# Altium project CPU_MOD.PrjPcb (part 1 of 2)
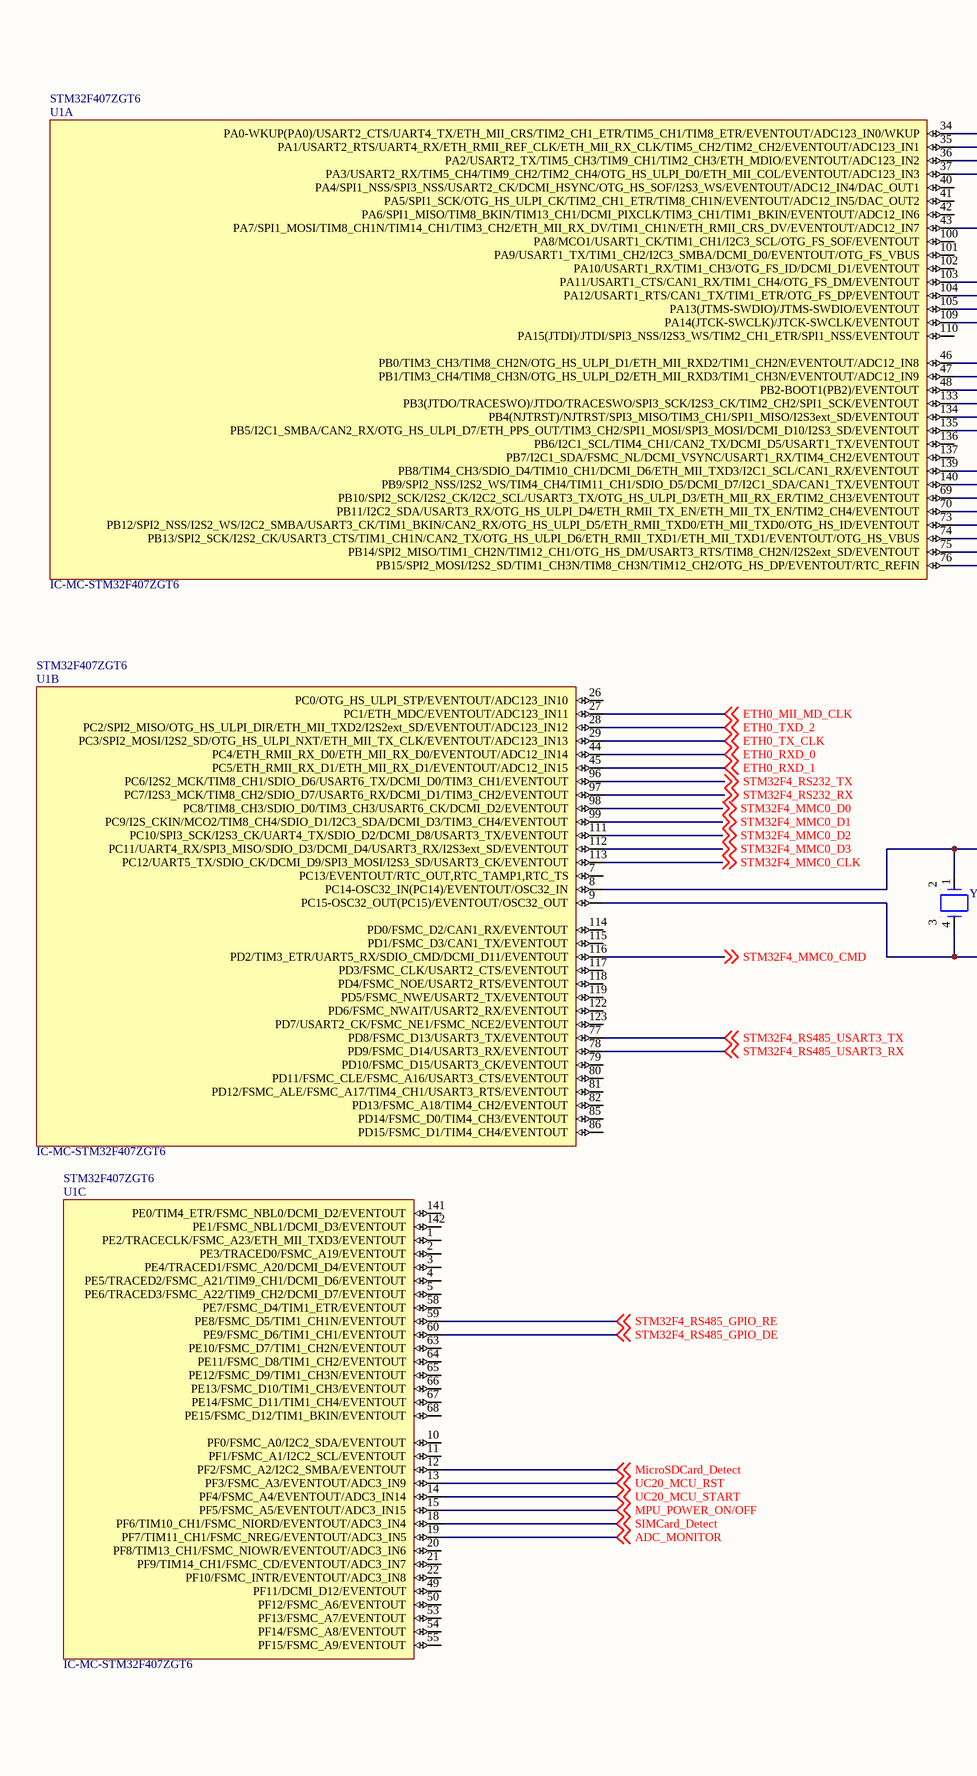
[diagram p0: [01] - CPU.SchDoc, left]
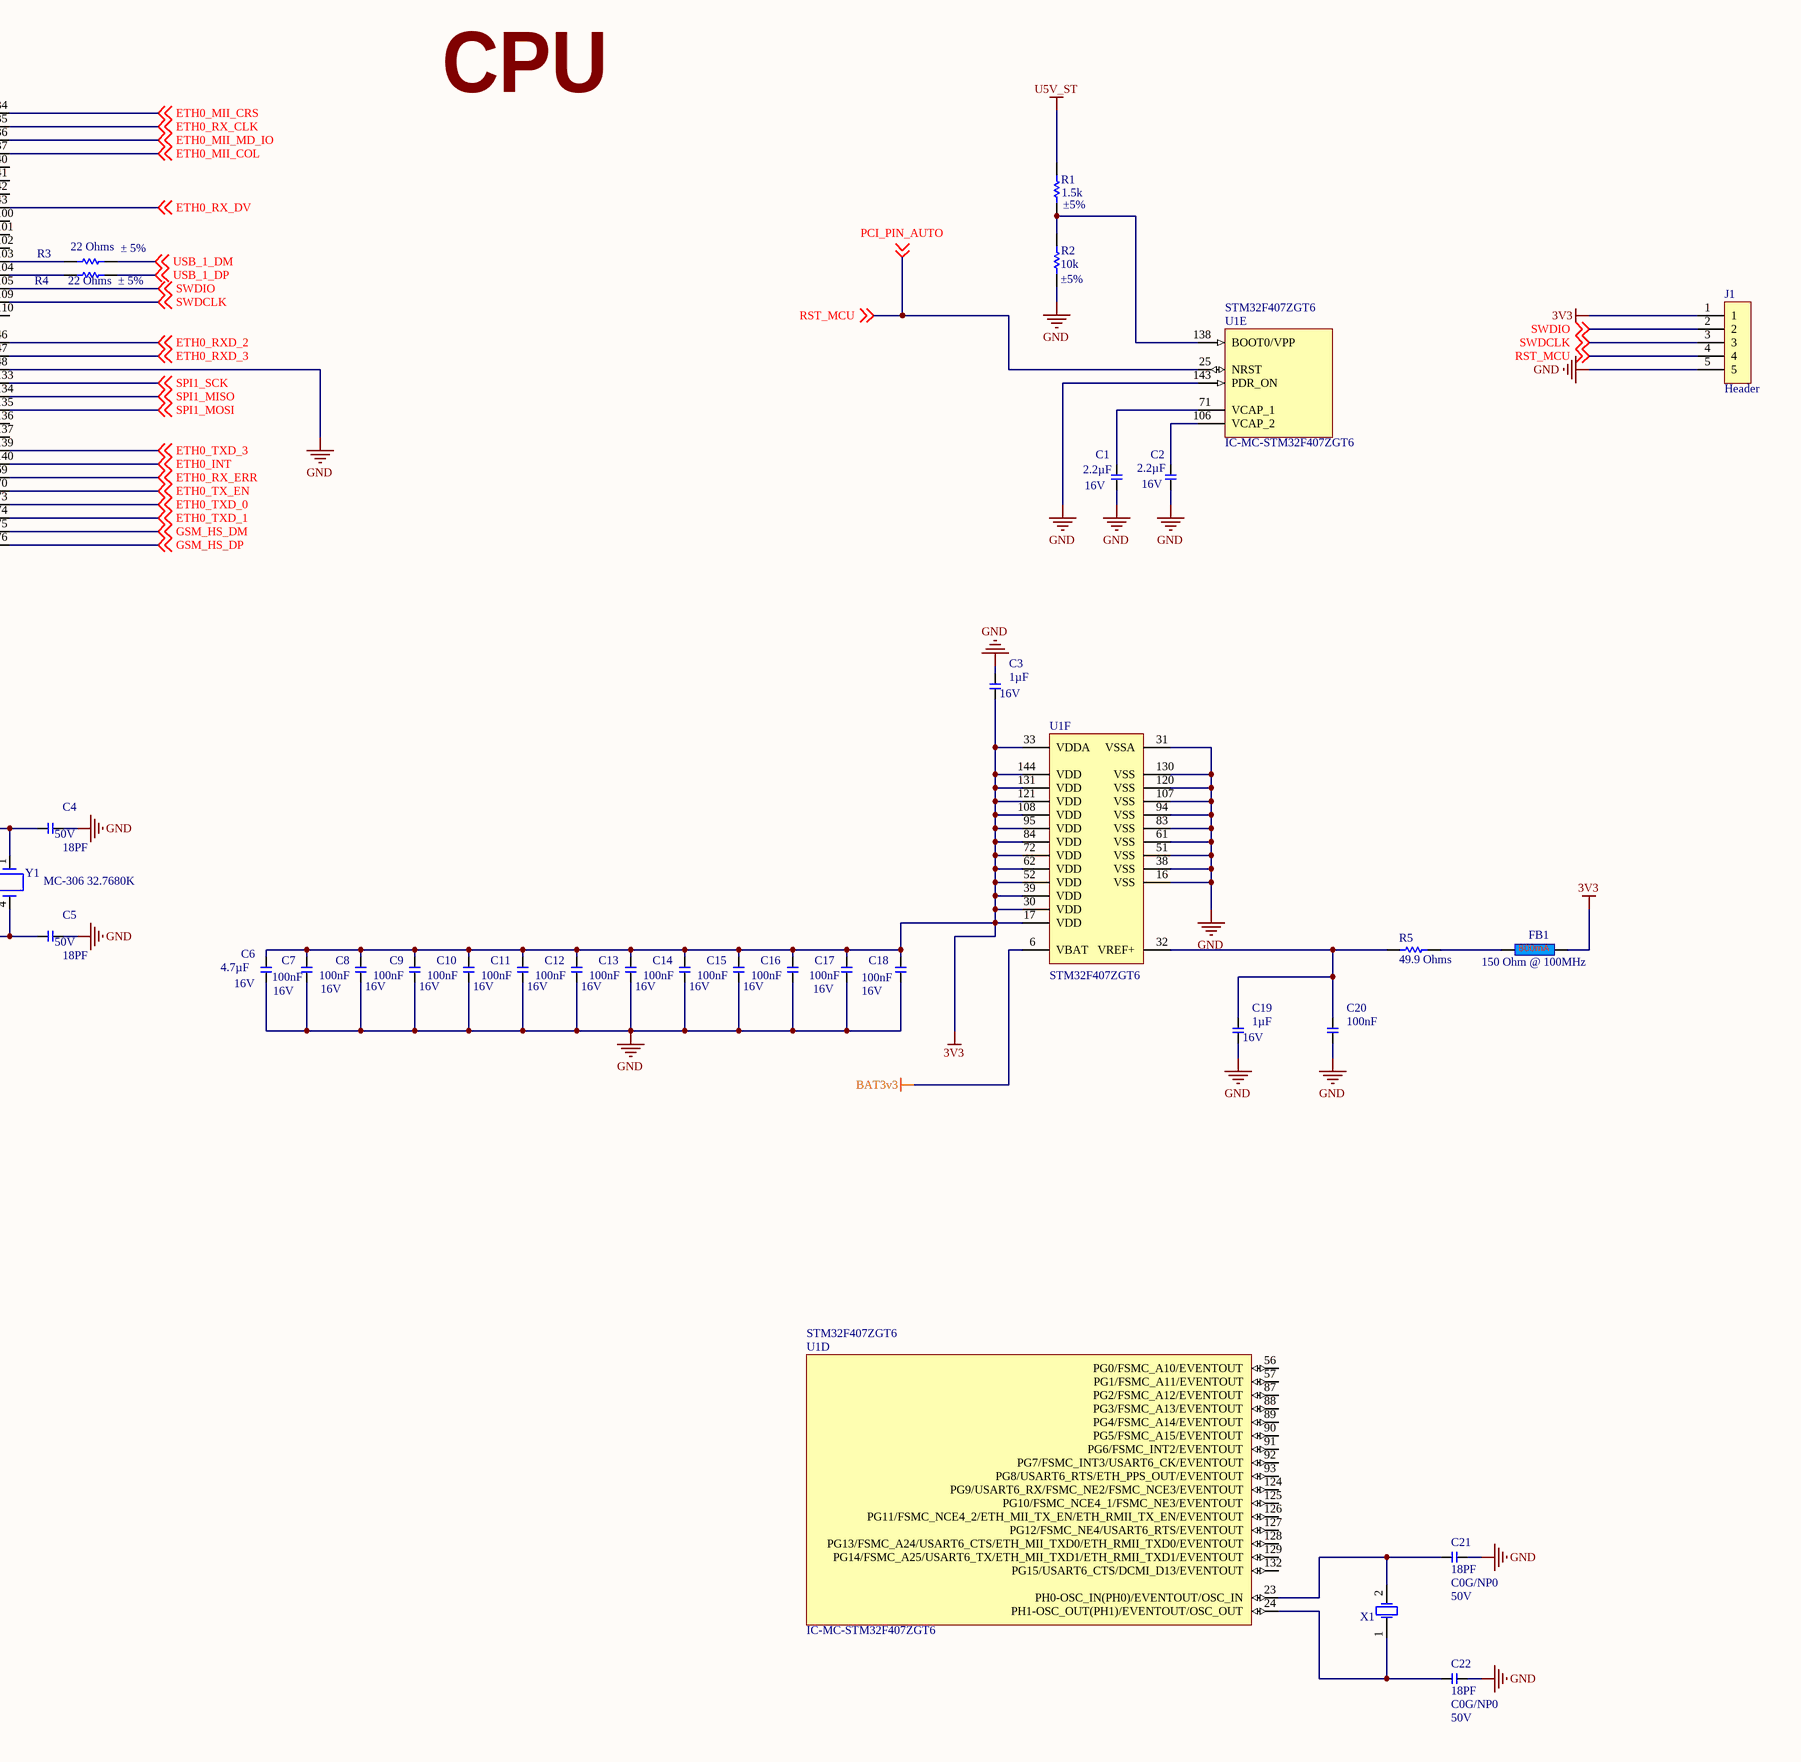
[diagram p1: [01] - CPU.SchDoc, right]
5 sheets, 70 parts. Net scope: global (net labels, ports and power ports of the same name join across sheets).
Board file: CPU_MOD.PcbDoc
Sheets:
  [01] - CPU.SchDoc
  [02] - RS232.SchDoc
  [03] - RS485.SchDoc
  [04] - ETHERNET.SchDoc
  [05] - MINIPCICONN.SchDoc

## Sheet [01] - CPU.SchDoc
size A2; Date: 25.05.2016; Engineer: Mustafa ÖZKAN; DocumentName: CPU Modul

### Parts
C1  Voltage - Rated: 16V  [C0805]  (hidden comment: 2.2µF)
C2  Voltage - Rated: 16V  [C0805]  (hidden comment: 2.2µF)
C3  1µF  Voltage - Rated: 16V  [C0805]
C4  18PF  voltage_rating_dc: 50V  [C0805]
C5  18PF  voltage_rating_dc: 50V  [C0805]
C6  4.7µF  Voltage - Rated: 16V  [C0805]
C7  100nF  Voltage - Rated: 16V  [C0805]
C8  100nF  Voltage - Rated: 16V  [C0805]
C9  100nF  Voltage - Rated: 16V  [C0805]
C10  100nF  Voltage - Rated: 16V  [C0805]
C11  100nF  Voltage - Rated: 16V  [C0805]
C12  100nF  Voltage - Rated: 16V  [C0805]
C13  100nF  Voltage - Rated: 16V  [C0805]
C14  100nF  Voltage - Rated: 16V  [C0805]
C15  100nF  Voltage - Rated: 16V  [C0805]
C16  100nF  Voltage - Rated: 16V  [C0805]
C17  100nF  Voltage - Rated: 16V  [C0805]
C18  100nF  Voltage - Rated: 16V  [C0805]
C19  1µF  Voltage - Rated: 16V  [C0805]
C20  100nF  [C0805]
C21  18PF  dielectric_characteristic: C0G/NP0  voltage_rating_dc: 50V  [C0805]
C22  18PF  dielectric_characteristic: C0G/NP0  voltage_rating_dc: 50V  [C0805]
FB1  150 Ohm @ 100MHz  [0805]
J1  Header  [Header 1x5 2.54mm]
R1  Tolerance: ±5%  [R0805]  (hidden comment: 1.5k)
R2  Tolerance: ±5%  Resistance (Ohms): 10k  [R0805]  (hidden comment: R-10K,%1,0805)
R3  22 Ohms  Resistance Tolerance: ± 5%  [R0805]
R4  22 Ohms  Resistance Tolerance: ± 5%  [R0805]
R5  49.9 Ohms  [R0805]
U1  IC-MC-STM32F407ZGT6  Manufacturer Part Number: STM32F407ZGT6  [STM-LQFP144_L]  (parts A,B,C,D,E,F of 6)
X1  ABM7-8.000MHZ  [SM_OSC_ABM3]  (value not drawn)
Y1  Manufacturer Part Number: MC-306 32.7680K  [CRSTAL_RTC]  (hidden comment: 32.7680 KHZ 12.5PF)

### Nets
3V3: C3.1 C6.2 C7.2 C8.2 C9.2 C10.2 C11.2 C12.2 C13.2 C14.2 C15.2 C16.2 C17.2 C18.2 FB1.2 J1.1 U1.17(VDD) U1.30(VDD) U1.33(VDDA) U1.39(VDD) U1.52(VDD) U1.62(VDD) U1.72(VDD) U1.84(VDD) U1.95(VDD) U1.108(VDD) U1.121(VDD) U1.131(VDD) U1.144(VDD)
BAT3v3: U1.6(VBAT)
GND: C1.1 C2.1 C3.2 C4.2 C5.2 C6.1 C7.1 C8.1 C9.1 C10.1 C11.1 C12.1 C13.1 C14.1 C15.1 C16.1 C17.1 C18.1 C19.1 C20.1 C21.2 C22.2 J1.5 R2.1 U1.16(VSS) U1.31(VSSA) U1.38(VSS) U1.48(PB2-BOOT1(PB2)/EVENTOUT) U1.51(VSS) U1.61(VSS) U1.83(VSS) U1.94(VSS) U1.107(VSS) U1.120(VSS) U1.130(VSS) U1.143(PDR_ON)
U5V_ST: R1.1
ADC_MONITOR: U1.19(PF7/TIM11_CH1/FSMC_NREG/EVENTOUT/ADC3_IN5) ; off-sheet ADC_MONITOR
ETH0_INT: U1.140(PB9/SPI2_NSS/I2S2_WS/TIM4_CH4/TIM11_CH1/SDIO_D5/DCMI_D7/I2C1_SDA/CAN1_TX/EVENTOUT) ; off-sheet ETH0_INT
ETH0_MII_COL: U1.37(PA3/USART2_RX/TIM5_CH4/TIM9_CH2/TIM2_CH4/OTG_HS_ULPI_D0/ETH_MII_COL/EVENTOUT/ADC123_IN3) ; off-sheet ETH0_MII_COL
ETH0_MII_CRS: U1.34(PA0-WKUP(PA0)/USART2_CTS/UART4_TX/ETH_MII_CRS/TIM2_CH1_ETR/TIM5_CH1/TIM8_ETR/EVENTOUT/ADC123_IN0/WKUP) ; off-sheet ETH0_MII_CRS
ETH0_MII_MD_CLK: U1.27(PC1/ETH_MDC/EVENTOUT/ADC123_IN11) ; off-sheet ETH0_MII_MD_CLK
ETH0_MII_MD_IO: U1.36(PA2/USART2_TX/TIM5_CH3/TIM9_CH1/TIM2_CH3/ETH_MDIO/EVENTOUT/ADC123_IN2) ; off-sheet ETH0_MII_MD_IO
ETH0_RX_CLK: U1.35(PA1/USART2_RTS/UART4_RX/ETH_RMII_REF_CLK/ETH_MII_RX_CLK/TIM5_CH2/TIM2_CH2/EVENTOUT/ADC123_IN1) ; off-sheet ETH0_RX_CLK
ETH0_RX_DV: U1.43(PA7/SPI1_MOSI/TIM8_CH1N/TIM14_CH1/TIM3_CH2/ETH_MII_RX_DV/TIM1_CH1N/ETH_RMII_CRS_DV/EVENTOUT/ADC12_IN7) ; off-sheet ETH0_RX_DV
ETH0_RX_ERR: U1.69(PB10/SPI2_SCK/I2S2_CK/I2C2_SCL/USART3_TX/OTG_HS_ULPI_D3/ETH_MII_RX_ER/TIM2_CH3/EVENTOUT) ; off-sheet ETH0_RX_ERR
ETH0_RXD_0: U1.44(PC4/ETH_RMII_RX_D0/ETH_MII_RX_D0/EVENTOUT/ADC12_IN14) ; off-sheet ETH0_RXD_0
ETH0_RXD_1: U1.45(PC5/ETH_RMII_RX_D1/ETH_MII_RX_D1/EVENTOUT/ADC12_IN15) ; off-sheet ETH0_RXD_1
ETH0_RXD_2: U1.46(PB0/TIM3_CH3/TIM8_CH2N/OTG_HS_ULPI_D1/ETH_MII_RXD2/TIM1_CH2N/EVENTOUT/ADC12_IN8) ; off-sheet ETH0_RXD_2
ETH0_RXD_3: U1.47(PB1/TIM3_CH4/TIM8_CH3N/OTG_HS_ULPI_D2/ETH_MII_RXD3/TIM1_CH3N/EVENTOUT/ADC12_IN9) ; off-sheet ETH0_RXD_3
ETH0_TX_CLK: U1.29(PC3/SPI2_MOSI/I2S2_SD/OTG_HS_ULPI_NXT/ETH_MII_TX_CLK/EVENTOUT/ADC123_IN13) ; off-sheet ETH0_TX_CLK
ETH0_TX_EN: U1.70(PB11/I2C2_SDA/USART3_RX/OTG_HS_ULPI_D4/ETH_RMII_TX_EN/ETH_MII_TX_EN/TIM2_CH4/EVENTOUT) ; off-sheet ETH0_TX_EN
ETH0_TXD_0: U1.73(PB12/SPI2_NSS/I2S2_WS/I2C2_SMBA/USART3_CK/TIM1_BKIN/CAN2_RX/OTG_HS_ULPI_D5/ETH_RMII_TXD0/ETH_MII_TXD0/OTG_HS_ID/EVENTOUT) ; off-sheet ETH0_TXD_0
ETH0_TXD_1: U1.74(PB13/SPI2_SCK/I2S2_CK/USART3_CTS/TIM1_CH1N/CAN2_TX/OTG_HS_ULPI_D6/ETH_RMII_TXD1/ETH_MII_TXD1/EVENTOUT/OTG_HS_VBUS) ; off-sheet ETH0_TXD_1
ETH0_TXD_2: U1.28(PC2/SPI2_MISO/OTG_HS_ULPI_DIR/ETH_MII_TXD2/I2S2ext_SD/EVENTOUT/ADC123_IN12) ; off-sheet ETH0_TXD_2
ETH0_TXD_3: U1.139(PB8/TIM4_CH3/SDIO_D4/TIM10_CH1/DCMI_D6/ETH_MII_TXD3/I2C1_SCL/CAN1_RX/EVENTOUT) ; off-sheet ETH0_TXD_3
GSM_HS_DM: U1.75(PB14/SPI2_MISO/TIM1_CH2N/TIM12_CH1/OTG_HS_DM/USART3_RTS/TIM8_CH2N/I2S2ext_SD/EVENTOUT) ; off-sheet GSM_HS_DM
GSM_HS_DP: U1.76(PB15/SPI2_MOSI/I2S2_SD/TIM1_CH3N/TIM8_CH3N/TIM12_CH2/OTG_HS_DP/EVENTOUT/RTC_REFIN) ; off-sheet GSM_HS_DP
MicroSDCard_Detect: U1.12(PF2/FSMC_A2/I2C2_SMBA/EVENTOUT) ; off-sheet MicroSDCard_Detect
MPU_POWER_ON/OFF: U1.15(PF5/FSMC_A5/EVENTOUT/ADC3_IN15) ; off-sheet MPU_POWER_ON/OFF
PCI_PIN_AUTO: J1.4 U1.25(NRST) ; off-sheet RST_MCU, off-sheet PCI_PIN_AUTO  [also labelled RST_MCU]  [project net ETH0RST]
SIMCard_Detect: U1.18(PF6/TIM10_CH1/FSMC_NIORD/EVENTOUT/ADC3_IN4) ; off-sheet SIMCard_Detect
SPI1_MISO: U1.134(PB4(NJTRST)/NJTRST/SPI3_MISO/TIM3_CH1/SPI1_MISO/I2S3ext_SD/EVENTOUT) ; off-sheet SPI1_MISO
SPI1_MOSI: U1.135(PB5/I2C1_SMBA/CAN2_RX/OTG_HS_ULPI_D7/ETH_PPS_OUT/TIM3_CH2/SPI1_MOSI/SPI3_MOSI/DCMI_D10/I2S3_SD/EVENTOUT) ; off-sheet SPI1_MOSI
SPI1_SCK: U1.133(PB3(JTDO/TRACESWO)/JTDO/TRACESWO/SPI3_SCK/I2S3_CK/TIM2_CH2/SPI1_SCK/EVENTOUT) ; off-sheet SPI1_SCK
STM32F4_MMC0_CLK: U1.113(PC12/UART5_TX/SDIO_CK/DCMI_D9/SPI3_MOSI/I2S3_SD/USART3_CK/EVENTOUT) ; off-sheet STM32F4_MMC0_CLK
STM32F4_MMC0_CMD: U1.116(PD2/TIM3_ETR/UART5_RX/SDIO_CMD/DCMI_D11/EVENTOUT) ; off-sheet STM32F4_MMC0_CMD
STM32F4_MMC0_D0: U1.98(PC8/TIM8_CH3/SDIO_D0/TIM3_CH3/USART6_CK/DCMI_D2/EVENTOUT) ; off-sheet STM32F4_MMC0_D0
STM32F4_MMC0_D1: U1.99(PC9/I2S_CKIN/MCO2/TIM8_CH4/SDIO_D1/I2C3_SDA/DCMI_D3/TIM3_CH4/EVENTOUT) ; off-sheet STM32F4_MMC0_D1
STM32F4_MMC0_D2: U1.111(PC10/SPI3_SCK/I2S3_CK/UART4_TX/SDIO_D2/DCMI_D8/USART3_TX/EVENTOUT) ; off-sheet STM32F4_MMC0_D2
STM32F4_MMC0_D3: U1.112(PC11/UART4_RX/SPI3_MISO/SDIO_D3/DCMI_D4/USART3_RX/I2S3ext_SD/EVENTOUT) ; off-sheet STM32F4_MMC0_D3
STM32F4_RS232_RX: U1.97(PC7/I2S3_MCK/TIM8_CH2/SDIO_D7/USART6_RX/DCMI_D1/TIM3_CH2/EVENTOUT) ; off-sheet STM32F4_RS232_RX
STM32F4_RS232_TX: U1.96(PC6/I2S2_MCK/TIM8_CH1/SDIO_D6/USART6_TX/DCMI_D0/TIM3_CH1/EVENTOUT) ; off-sheet STM32F4_RS232_TX
STM32F4_RS485_GPIO_DE: U1.60(PE9/FSMC_D6/TIM1_CH1/EVENTOUT) ; off-sheet STM32F4_RS485_GPIO_DE  [project net RS485_DE]
STM32F4_RS485_GPIO_RE: U1.59(PE8/FSMC_D5/TIM1_CH1N/EVENTOUT) ; off-sheet STM32F4_RS485_GPIO_RE  [project net RS485_RE]
STM32F4_RS485_USART3_RX: U1.78(PD9/FSMC_D14/USART3_RX/EVENTOUT) ; off-sheet STM32F4_RS485_USART3_RX  [project net RS485_R]
STM32F4_RS485_USART3_TX: U1.77(PD8/FSMC_D13/USART3_TX/EVENTOUT) ; off-sheet STM32F4_RS485_USART3_TX  [project net RS485_D]
SWDCLK: J1.3 U1.109(PA14(JTCK-SWCLK)/JTCK-SWCLK/EVENTOUT) ; off-sheet SWDCLK
SWDIO: J1.2 U1.105(PA13(JTMS-SWDIO)/JTMS-SWDIO/EVENTOUT) ; off-sheet SWDIO
UC20_MCU_RST: U1.13(PF3/FSMC_A3/EVENTOUT/ADC3_IN9) ; off-sheet UC20_MCU_RST
UC20_MCU_START: U1.14(PF4/FSMC_A4/EVENTOUT/ADC3_IN14) ; off-sheet UC20_MCU_START
USB_1_DM: R3.2 ; off-sheet USB_1_DM
USB_1_DP: R4.2 ; off-sheet USB_1_DP
NetC1_2: C1.2 U1.71(VCAP_1)
NetC2_2: C2.2 U1.106(VCAP_2)
NetC4_1: C4.1 U1.8(PC14-OSC32_IN(PC14)/EVENTOUT/OSC32_IN) Y1.1
NetC5_1: C5.1 U1.9(PC15-OSC32_OUT(PC15)/EVENTOUT/OSC32_OUT) Y1.4
NetC19_2: C19.2 C20.2 R5.1 U1.32(VREF+)
NetC21_1: C21.1 U1.23(PH0-OSC_IN(PH0)/EVENTOUT/OSC_IN) X1.2(OSC2)
NetC22_1: C22.1 U1.24(PH1-OSC_OUT(PH1)/EVENTOUT/OSC_OUT) X1.1(OSC1)
NetFB1_1: FB1.1 R5.2
NetR1_2: R1.2 R2.2 U1.138(BOOT0/VPP)
NetR3_1: R3.1 U1.103(PA11/USART1_CTS/CAN1_RX/TIM1_CH4/OTG_FS_DM/EVENTOUT)
NetR4_1: R4.1 U1.104(PA12/USART1_RTS/CAN1_TX/TIM1_ETR/OTG_FS_DP/EVENTOUT)

Not connected (* = marked no-connect by the designer): U1 1(PE2/TRACECLK/FSMC_A23/ETH_MII_TXD3/EVENTOUT) 2(PE3/TRACED0/FSMC_A19/EVENTOUT) 3(PE4/TRACED1/FSMC_A20/DCMI_D4/EVENTOUT) 4(PE5/TRACED2/FSMC_A21/TIM9_CH1/DCMI_D6/EVENTOUT) 5(PE6/TRACED3/FSMC_A22/TIM9_CH2/DCMI_D7/EVENTOUT) 7(PC13/EVENTOUT/RTC_OUT,RTC_TAMP1,RTC_TS) 10(PF0/FSMC_A0/I2C2_SDA/EVENTOUT) 11(PF1/FSMC_A1/I2C2_SCL/EVENTOUT) 20(PF8/TIM13_CH1/FSMC_NIOWR/EVENTOUT/ADC3_IN6) 21(PF9/TIM14_CH1/FSMC_CD/EVENTOUT/ADC3_IN7) 22(PF10/FSMC_INTR/EVENTOUT/ADC3_IN8) 26(PC0/OTG_HS_ULPI_STP/EVENTOUT/ADC123_IN10) 40(PA4/SPI1_NSS/SPI3_NSS/USART2_CK/DCMI_HSYNC/OTG_HS_SOF/I2S3_WS/EVENTOUT/ADC12_IN4/DAC_OUT1) 41(PA5/SPI1_SCK/OTG_HS_ULPI_CK/TIM2_CH1_ETR/TIM8_CH1N/EVENTOUT/ADC12_IN5/DAC_OUT2) 42(PA6/SPI1_MISO/TIM8_BKIN/TIM13_CH1/DCMI_PIXCLK/TIM3_CH1/TIM1_BKIN/EVENTOUT/ADC12_IN6) 49(PF11/DCMI_D12/EVENTOUT) 50(PF12/FSMC_A6/EVENTOUT) 53(PF13/FSMC_A7/EVENTOUT) 54(PF14/FSMC_A8/EVENTOUT) 55(PF15/FSMC_A9/EVENTOUT) 56(PG0/FSMC_A10/EVENTOUT) 57(PG1/FSMC_A11/EVENTOUT) 58(PE7/FSMC_D4/TIM1_ETR/EVENTOUT) 63(PE10/FSMC_D7/TIM1_CH2N/EVENTOUT) 64(PE11/FSMC_D8/TIM1_CH2/EVENTOUT) 65(PE12/FSMC_D9/TIM1_CH3N/EVENTOUT) 66(PE13/FSMC_D10/TIM1_CH3/EVENTOUT) 67(PE14/FSMC_D11/TIM1_CH4/EVENTOUT) 68(PE15/FSMC_D12/TIM1_BKIN/EVENTOUT) 79(PD10/FSMC_D15/USART3_CK/EVENTOUT) 80(PD11/FSMC_CLE/FSMC_A16/USART3_CTS/EVENTOUT) 81(PD12/FSMC_ALE/FSMC_A17/TIM4_CH1/USART3_RTS/EVENTOUT) 82(PD13/FSMC_A18/TIM4_CH2/EVENTOUT) 85(PD14/FSMC_D0/TIM4_CH3/EVENTOUT) 86(PD15/FSMC_D1/TIM4_CH4/EVENTOUT) 87(PG2/FSMC_A12/EVENTOUT) 88(PG3/FSMC_A13/EVENTOUT) 89(PG4/FSMC_A14/EVENTOUT) 90(PG5/FSMC_A15/EVENTOUT) 91(PG6/FSMC_INT2/EVENTOUT) 92(PG7/FSMC_INT3/USART6_CK/EVENTOUT) 93(PG8/USART6_RTS/ETH_PPS_OUT/EVENTOUT) 100(PA8/MCO1/USART1_CK/TIM1_CH1/I2C3_SCL/OTG_FS_SOF/EVENTOUT) 101(PA9/USART1_TX/TIM1_CH2/I2C3_SMBA/DCMI_D0/EVENTOUT/OTG_FS_VBUS) 102(PA10/USART1_RX/TIM1_CH3/OTG_FS_ID/DCMI_D1/EVENTOUT) 110(PA15(JTDI)/JTDI/SPI3_NSS/I2S3_WS/TIM2_CH1_ETR/SPI1_NSS/EVENTOUT) 114(PD0/FSMC_D2/CAN1_RX/EVENTOUT) 115(PD1/FSMC_D3/CAN1_TX/EVENTOUT) 117(PD3/FSMC_CLK/USART2_CTS/EVENTOUT) 118(PD4/FSMC_NOE/USART2_RTS/EVENTOUT) 119(PD5/FSMC_NWE/USART2_TX/EVENTOUT) 122(PD6/FSMC_NWAIT/USART2_RX/EVENTOUT) 123(PD7/USART2_CK/FSMC_NE1/FSMC_NCE2/EVENTOUT) 124(PG9/USART6_RX/FSMC_NE2/FSMC_NCE3/EVENTOUT) 125(PG10/FSMC_NCE4_1/FSMC_NE3/EVENTOUT) 126(PG11/FSMC_NCE4_2/ETH_MII_TX_EN/ETH_RMII_TX_EN/EVENTOUT) 127(PG12/FSMC_NE4/USART6_RTS/EVENTOUT) 128(PG13/FSMC_A24/USART6_CTS/ETH_MII_TXD0/ETH_RMII_TXD0/EVENTOUT) 129(PG14/FSMC_A25/USART6_TX/ETH_MII_TXD1/ETH_RMII_TXD1/EVENTOUT) 132(PG15/USART6_CTS/DCMI_D13/EVENTOUT) 136(PB6/I2C1_SCL/TIM4_CH1/CAN2_TX/DCMI_D5/USART1_TX/EVENTOUT) 137(PB7/I2C1_SDA/FSMC_NL/DCMI_VSYNC/USART1_RX/TIM4_CH2/EVENTOUT) 141(PE0/TIM4_ETR/FSMC_NBL0/DCMI_D2/EVENTOUT) 142(PE1/FSMC_NBL1/DCMI_D3/EVENTOUT); Y1 2 3

### Notes on the sheet
- CPU

### Library data of the parts
C1 C2 = C-2.2UF,16V,0805: KEMET - C0805C225K4RACTU - CAP, MLCC, X7R, 2.2UF, 16V, 0805; Tolerance: ±10%; Supplier 1: Digi-Key; Manufacturer: Kemet; Manufacturer Part Number: C0805C225K4RACTU; RoHS: RoHS Compliant; Stock 1: 60102; Pricing 1: 1=0.36, 10=0.315, 50=0.1912, 100=0.1575, 250=0.126, 500=0.11476, 1000=0.1035 (USD); ComponentLink1URL: http://www.kemet.com/docfinder?Partnumber=C0805C225K4RACTU; ComponentLink1Description: http://www.kemet.com/docfinder?Partnumber=C0805C225K4RACTU; Supplier Part Number 1: 399-3523-1-ND; Category: Capacitors; Packaging: Cut Tape (CT); Temperature Coefficient: X7R; Mounting Type: Surface Mount, MLCC; Operating Temperature: -55°C ~ 125°C; Applications: General Purpose; Ratings: -; Package / Case: 0805 (2012 Metric); Size / Dimension: 0.079" L x 0.049" W (2.00mm x 1.25mm); Height - Seated (Max): -; Thickness (Max): 0.055" (1.40mm); Lead Spacing: -; Features: Low ESL; Lead Style: -; Capacitance: 2.2µF
C3 C19 = C-1UF,16V,0805: AVX - 0805YC105KAT2A - CAP, MLCC, X7R, 1UF, 16V, 0805; Manufacturer: AVX Corporation; Tolerance: ±10%; Supplier 1: Digi-Key; Manufacturer Part Number: 0805YC105KAT2A; RoHS: RoHS Compliant; Stock 1: 76930; Pricing 1: 1=0.19, 10=0.132, 25=0.0964, 50=0.075, 100=0.0622, 250=0.05148, 500=0.04362, 1000=0.03611 (USD); Capacitance: 1µF; Packaging: Cut Tape (CT); ComponentLink1URL: http://datasheets.avx.com/X7RDielectric.pdf; ComponentLink1Description: http://datasheets.avx.com/X7RDielectric.pdf; Supplier Part Number 1: 478-5034-1-ND; Category: Capacitors; Temperature Coefficient: X7R; Mounting Type: Surface Mount, MLCC; Operating Temperature: -55°C ~ 125°C; Applications: General Purpose; Ratings: -; Package / Case: 0805 (2012 Metric); Size / Dimension: 0.079" L x 0.049" W (2.01mm x 1.25mm); Height - Seated (Max): -; Thickness (Max): 0.055" (1.40mm); Lead Spacing: -; Features: -; Lead Style: -
C4 C5 C21 C22 = C-18PF,50V,0805: MULTICOMP - MC0805N180J500CT - CAP, MLCC, C0G/NP0, 18PF, 50V,0805, REEL; capacitance_tolerance: ±5%; pin_count: 2; Supplier 1: Octopart; Manufacturer: Multicomp; Manufacturer Part Number: MC0805N180J500CT; Pricing 1: 1=0.11400, 10=0.07300, 50=0.04100, 100=0.03200, 250=0.02600, 500=0.02200, 1000=0.01800 (USD); capacitance: 18PF; ComponentLink1URL: http://datasheet.octopart.com/MC0805N180J500CT-Multicomp-datasheet-16478625.pdf; ComponentLink1Description: http://datasheet.octopart.com/MC0805N180J500CT-Multicomp-datasheet-16478625.pdf; Supplier Part Number 1: Newark - 06R4039; Stock 1: 3187; reach_svhc_compliance: No SVHC; rohs_status: Compliant; Octopart Url: http://octopart.com/mc0805n180j500ct-multicomp-10529169; Seller Landing  Url: https://octopart-clicks.com/click/track?country=TR&ak=8157f166&sig=03c9fd1&sid=2402&ppid=10529169&vpid=17760821&ct=offers; OctopartID: 811748bd0de05ed0; ComponentLink2URL: http://datasheet.octopart.com/MC0805N180J500CT-Multicomp-datasheet-22150886.pdf; ComponentLink2Description: http://datasheet.octopart.com/MC0805N180J500CT-Multicomp-datasheet-22150886.pdf; ComponentLink3URL: http://datasheet.octopart.com/MC0805N180J500CT-Multicomp-datasheet-8445804.pdf; ComponentLink3Description: http://datasheet.octopart.com/MC0805N180J500CT-Multicomp-datasheet-8445804.pdf; ComponentLink4URL: http://datasheet.octopart.com/MC0805N180J500CT-Multicomp-datasheet-34215986.pdf; ComponentLink4Description: http://datasheet.octopart.com/MC0805N180J500CT-Multicomp-datasheet-34215986.pdf; ComponentLink5URL: http://datasheet.octopart.com/MC0805N180J500CT-Multicomp-datasheet-26590290.pdf; ComponentLink5Description: http://datasheet.octopart.com/MC0805N180J500CT-Multicomp-datasheet-26590290.pdf; ComponentLink6URL: http://datasheet.octopart.com/MC0805N180J500CT-Multicomp-datasheet-15500401.pdf; ComponentLink6Description: http://datasheet.octopart.com/MC0805N180J500CT-Multicomp-datasheet-15500401.pdf; ComponentLink7URL: http://datasheet.octopart.com/MC0805N180J500CT-Multicomp-datasheet-10838970.pdf; ComponentLink7Description: http://datasheet.octopart.com/MC0805N180J500CT-Multicomp-datasheet-10838970.pdf
  C4 C5: dielectric_characteristic: C0G/NP0
C6 = C-4.7UF,16V,0805: AVX - 0805YC475KAT2A - CAP, MLCC, X7R, 4.7UF, 16V, 0805; Manufacturer: AVX Corporation; Tolerance: ±10%; Supplier 1: Digi-Key; Manufacturer Part Number: 0805YC475KAT2A; RoHS: RoHS Compliant; Stock 1: 16611; Pricing 1: 1=0.78, 10=0.578, 25=0.4952, 50=0.462, 100=0.396, 250=0.363, 500=0.3135, 1000=0.264 (USD); Capacitance: 4.7µF; Packaging: Cut Tape (CT); ComponentLink1URL: http://datasheets.avx.com/X7RDielectric.pdf; ComponentLink1Description: http://datasheets.avx.com/X7RDielectric.pdf; Supplier Part Number 1: 478-5722-1-ND; Category: Capacitors; Temperature Coefficient: X7R; Mounting Type: Surface Mount, MLCC; Operating Temperature: -55°C ~ 125°C; Applications: General Purpose; Ratings: -; Package / Case: 0805 (2012 Metric); Size / Dimension: 0.079" L x 0.049" W (2.01mm x 1.25mm); Height - Seated (Max): -; Thickness (Max): 0.060" (1.52mm); Lead Spacing: -; Features: -; Lead Style: -
C7-C18 C20 = C-100NF,16V,0805: AVX - 0805YA103JAT2A - CAP, MLCC, C0G/NP0, 10NF, 16V, 0805; Tolerance: ±5%; Temperature Coefficient: C0G, NP0; Supplier 1: Digi-Key; Manufacturer: AVX; Manufacturer Part Number: 0805YA103JAT2A; RoHS: YES; Category: Capacitors; Stock 1: 28062; Pricing 1: 1=0.29, 10=0.204, 25=0.1668, 50=0.1424, 100=0.1221, 250=0.10176, 500=0.09158, 1000=0.07733 (USD); Packaging: Cut Tape (CT); Capacitance: 100nF; Mounting Type: Surface Mount, MLCC; Operating Temperature: -55°C ~ 125°C; Applications: General Purpose; Ratings: -; Package / Case: 0805 (2012 Metric); Size / Dimension: 0.079" L x 0.049" W (2.01mm x 1.25mm); Height - Seated (Max): -; Thickness (Max): 0.037" (0.94mm); Lead Spacing: -; Features: -; Lead Style: -; ComponentLink1URL: http://www.avx.com/docs/Catalogs/ccog.pdf; ComponentLink1Description: http://www.avx.com/docs/Catalogs/ccog.pdf; Supplier Part Number 1: 478-1334-1-ND; ComponentLink2URL: http://www.farnell.com/datasheets/1825494.pdf; ComponentLink2Description: http://www.farnell.com/datasheets/1825494.pdf; ComponentLink3URL: http://datasheets.avx.com/C0GNP0-Dielectric.pdf; ComponentLink3Description: http://datasheets.avx.com/C0GNP0-Dielectric.pdf
  C20: Voltage - Rated: 16V
FB1 = L-150OHM,800MA: FERRITE 800MA 150 OHM 0805 SMD; Manufacturer: Laird-Signal Integrity Products; Manufacturer Part Number: LI0805H151R-10; DC Resistance (DCR): 150 mOhm Max; Filter Type: Differential Mode - Single; Supplier 1: Digi-Key; RoHS: RoHS Compliant; Category: Filters; Stock 1: 418596; Pricing 1: 1=0.1, 10=0.07, 25=0.064, 50=0.0574, 100=0.0421, 250=0.03064, 500=0.02808, 1000=0.02424 (USD); Packaging: Cut Tape (CT); Impedance @ Frequency: 150 Ohm @ 100MHz; Current Rating: 800mA; Package / Case: 0805 (2012 Metric); Mounting Type: Surface Mount; Height (Max): 0.043" (1.10mm); Size / Dimension: 0.079" L x 0.049" W (2.00mm x 1.25mm); ComponentLink1URL: http://www.lairdtech.com/WorkArea/linkit.aspx?LinkIdentifier=id&ItemID=4912; ComponentLink1Description: http://www.lairdtech.com/WorkArea/linkit.aspx?LinkIdentifier=id&ItemID=4912; Supplier Part Number 1: 240-2384-1-ND
J1 = CON-Header 1X5 2.54MM: Header 1X5 2.54
R1 = R-1.5K,%1,0805: RES SMD 1.5K OHM 1% 1/8W 0805; Manufacturer: Yageo; Manufacturer Part Number: RC0805FR-071K5L; Temperature Coefficient: ±100ppm/°C; Power (Watts): 0.125W, 1/8W; Supplier 1: Digi-Key; RoHS: RoHS Compliant; Stock 1: 815764; Pricing 1: 1=0.1, 10=0.021, 25=0.0152, 100=0.0084, 250=0.00644, 500=0.00514, 1000=0.00379, 2500=0.00329 (USD); Packaging: Digi-Reel®; ComponentLink1URL: http://www.yageo.com/documents/recent/PYu-RC_Group_51_RoHS_L_04.pdf; ComponentLink1Description: http://www.yageo.com/documents/recent/PYu-RC_Group_51_RoHS_L_04.pdf; ComponentLink2URL: http://www.vishay.com/docs/20035/dcrcwe3.pdf; ComponentLink2Description: http://www.vishay.com/docs/20035/dcrcwe3.pdf; Supplier Part Number 1: 311-1.50KCRDKR-ND; Category: Resistors; Composition: Thick Film; Features: Moisture Resistant; Operating Temperature: -55°C ~ 155°C; Package / Case: 0805 (2012 Metric); Supplier Device Package: 0805; Size / Dimension: 0.079" L x 0.049" W (2.00mm x 1.25mm); Height: 0.024" (0.60mm); Number of Terminations: 2; Supplier 2: Digi-Key; Stock 2: 28544; Pricing 2: 1=0.1, 10=0.054, 25=0.0392, 50=0.03, 100=0.0221, 250=0.01684, 500=0.01346, 1000=0.00991, 2500=0.0086 (USD); Part Status: Active; Failure Rate: -; Resistance (Ohms): 1.5k
R2 = R-10K,%1,0805: RES SMD 10K OHM 1% 1/8W 0805; Manufacturer: Yageo; Manufacturer Part Number: RC0805FR-0710KL; Temperature Coefficient: ±100ppm/°C; Power (Watts): 0.125W, 1/8W; Supplier 1: Digi-Key; RoHS: RoHS Compliant; Stock 1: 4020575; Pricing 1: 1=0.1, 10=0.021, 25=0.0152, 100=0.0084, 250=0.00644, 500=0.00514, 1000=0.00379, 2500=0.00329 (USD); Packaging: Cut Tape (CT); ComponentLink1URL: http://www.yageo.com/documents/recent/PYu-RC_Group_51_RoHS_L_04.pdf; ComponentLink1Description: http://www.yageo.com/documents/recent/PYu-RC_Group_51_RoHS_L_04.pdf; Supplier Part Number 1: 311-10.0KCRCT-ND; Category: Resistors; Composition: Thick Film; Features: Moisture Resistant; Operating Temperature: -55°C ~ 155°C; Package / Case: 0805 (2012 Metric); Supplier Device Package: 0805; Size / Dimension: 0.079" L x 0.049" W (2.00mm x 1.25mm); Height: 0.024" (0.60mm); Number of Terminations: 2
R3 R4 = R-22R,0805: PANASONIC - ERJP06F22R0V - RESISTOR, THICK FILM, 22 OHM, 0.5W, 1%; Product Range: PANASONIC - ERJ Series; Power Rating: 500; Resistor Case Style: 0805 [2012 Metric]; Temperature Coefficient: ± 300; Voltage Rating: 400; SVHC: No SVHC (16-Dec-2013); External Depth: 1.25; External Length / Height: 0.6; External Width: 2; Overload Voltage: 600; Reel Quantity: 5000; Resistor Mounting: SMD; Manufacturer: PANASONIC; Manufacturer Part Number: ERJP06F22R0V; RoHS: YES; Resistance: 22 Ohms; Resistor Element Material: Thick Film; Packaging: Cut Tape; MSL: -; No. of Pins: 2; Operating Temperature Max: 155; Operating Temperature Min: -55; Operating Temperature Range: -55°C to +155; Series: ERJP<!--FANDB--><div class="features-and-benefits-container"></div>; ComponentLink1URL: http://www.farnell.com/datasheets/1801181.pdf; ComponentLink1Description: http://www.farnell.com/datasheets/1801181.pdf; ComponentLink2URL: http://www.farnell.com/datasheets/1718548.pdf; ComponentLink2Description: http://www.farnell.com/datasheets/1718548.pdf; ComponentLink3URL: http://www.farnell.com/cad/1697897.zip; ComponentLink3Description: http://www.farnell.com/cad/1697897.zip; Supplier 1: Farnell; Stock 1: 4425; Pricing 1: 25=0,139, 100=0,113, 500=0,0897, 1000=0,0676, 5000=0,065 (EUR); Supplier Part Number 1: 1750733
R5 = R-49.9R,0805: PANASONIC - ERJP06F49R9V - RESISTOR, THICK FILM, 49.9 OHM, 0.5W, 1%; Product Range: PANASONIC - ERJ Series; Power Rating: 500; Resistor Case Style: 0805 [2012 Metric]; Temperature Coefficient: ± 100; Voltage Rating: 400; SVHC: No SVHC (16-Dec-2013; Supplier 1: Farnell; Manufacturer: PANASONIC; Manufacturer Part Number: ERJP06F49R9V; RoHS: YES; Stock 1: 3370; Pricing 1: 25=0,078, 100=0,0728, 500=0,0429, 1000=0,0312, 5000=0,0234 (EUR); Resistance: 49.9 Ohms; Resistance Tolerance: ± 1%; Resistor Element Material: Thick Film; Packaging: Cut Tape; MSL: -; ComponentLink1URL: http://www.farnell.com/datasheets/1801181.pdf; ComponentLink1Description: http://www.farnell.com/datasheets/1801181.pdf; ComponentLink2URL: http://www.farnell.com/datasheets/1718548.pdf; ComponentLink2Description: http://www.farnell.com/datasheets/1718548.pdf; Supplier Part Number 1: 2312274
U1 = IC-MC-STM32F407ZGT6: IC MCU 32BIT 1MB FLASH 144LQFP; Manufacturer: STMicroelectronics; Core Processor: ARM® Cortex®-M4; Core Size: 32-Bit; Speed: 168MHz; Connectivity: CAN, DCMI, EBI/EMI, Ethernet, I²C, IrDA, LIN, SPI, UART/USART, USB OTG; Peripherals: Brown-out Detect/Reset, DMA, I²S, LCD, POR, PWM, WDT; Number of I/O: 114; Program Memory Size: 1MB (1M x 8); RAM Size: 192K x 8; Voltage - Supply (Vcc/Vdd): 1.8 V ~ 3.6 V; Data Converters: A/D 24x12b, D/A 2x12b; Oscillator Type: Internal; Supplier 1: Digi-Key; Supplier Part Number 1: 497-11766-ND; RoHS: RoHS Compliant; Category: Integrated Circuits (ICs); Stock 1: 1913; Pricing 1: 1=13.06, 10=12.005, 100=10.1386, 500=9.019, 1000=8.2726 (USD); Packaging: Tray; Program Memory Type: FLASH; EEPROM Size: -; Operating Temperature: -40°C ~ 85°C (TA); Package / Case: 144-LQFP; Supplier Device Package: 144-LQFP (20x20); ComponentLink1URL: http://www.st.com/web/en/resource/technical/document/datasheet/DM00037051.pdf; ComponentLink1Description: http://www.st.com/web/en/resource/technical/document/datasheet/DM00037051.pdf
X1 = OSC-ABM7-8.000MHZ-D2Y-T: CRYSTAL 8.0000MHZ 18PF SMD; Manufacturer: Abracon LLC; Frequency: 8MHz; Frequency Stability: ±30ppm; Frequency Tolerance: ±20ppm; ESR (Equivalent Series Resistance): 100 Ohm; Operating Mode: Fundamental; Supplier 1: Digi-Key; Manufacturer Part Number: ABM7-8.000MHZ-D2Y-T; RoHS: RoHS Compliant; Pricing 1: 1=0.76, 10=0.678, 50=0.6328, 100=0.56, 500=0.5292 (USD); Load Capacitance: 18pF; ComponentLink1URL: http://www.abracon.com/Resonators/abm7.pdf; ComponentLink1Description: http://www.abracon.com/Resonators/abm7.pdf; Supplier Part Number 1: 535-9831-1-ND; Category: Crystals and Oscillators; Stock 1: 111842; Packaging: Cut Tape (CT); Type: MHz Crystal; Operating Temperature: -40°C ~ 85°C; Ratings: -; Mounting Type: Surface Mount; Package / Case: 2-SMD, No Lead (DFN, LCC); Size / Dimension: 0.236" L x 0.138" W (6.00mm x 3.50mm); Height: 0.055" (1.40mm)
Y1 = OSC-CRYSTAL 32.7680 KHZ: CRYSTAL 32.7680 KHZ 12.5PF SMD; Manufacturer: EPSON; Frequency: 32.768kHz; Frequency Tolerance: ±100ppm; ESR (Equivalent Series Resistance): 50 kOhm; Operating Mode: Fundamental; Supplier 1: Digi-Key; Supplier Part Number 1: SER4094CT-ND; RoHS: RoHS Compliant; Category: Crystals and Oscillators; Stock 1: 0; Pricing 1: 1=0.54, 10=0.447, 50=0.4012, 100=0.357, 500=0.34 (USD); Packaging: Cut Tape (CT); Type: kHz Crystal (Tuning Fork); Frequency Stability: -; Load Capacitance: 12.5pF; Operating Temperature: -40°C ~ 85°C; Ratings: -; Mounting Type: Surface Mount; Package / Case: 4-SMD, J-Lead; Size / Dimension: 0.315" L x 0.126" W (8.00mm x 3.20mm); Height: 0.100" (2.54mm); ComponentLink1URL: https://support.epson.biz/td/api/doc_check.php?dl=brief_MC-306_en.pdf; ComponentLink1Description: https://support.epson.biz/td/api/doc_check.php?dl=brief_MC-306_en.pdf

## Sheet [02] - RS232.SchDoc
size A4
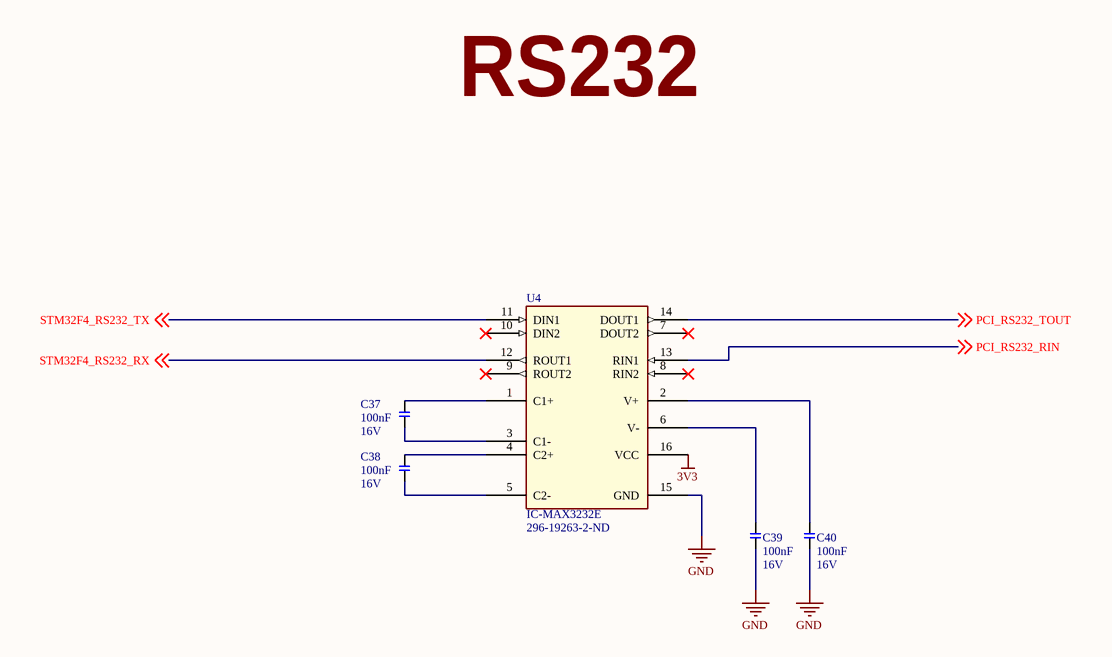
[diagram p2: [02] - RS232.SchDoc]

### Parts
C37  100nF  Voltage - Rated: 16V  [C0805]
C38  100nF  Voltage - Rated: 16V  [C0805]
C39  100nF  Voltage - Rated: 16V  [C0805]
C40  100nF  Voltage - Rated: 16V  [C0805]
U4  IC-MAX3232E  Supplier Part Number 1: 296-19263-2-ND  [TI-DW16_M]

### Nets
3V3: U4.16(VCC)
GND: C39.1 C40.1 U4.15(GND)
PCI_RS232_RIN: U4.13(RIN1) ; off-sheet PCI_RS232_RIN
PCI_RS232_TOUT: U4.14(DOUT1) ; off-sheet PCI_RS232_TOUT
STM32F4_RS232_RX: U4.12(ROUT1) ; off-sheet STM32F4_RS232_RX
STM32F4_RS232_TX: U4.11(DIN1) ; off-sheet STM32F4_RS232_TX
NetC37_1: C37.1 U4.3(C1-)
NetC37_2: C37.2 U4.1(C1+)
NetC38_1: C38.1 U4.5(C2-)
NetC38_2: C38.2 U4.4(C2+)
NetC39_2: C39.2 U4.6(V-)
NetC40_2: C40.2 U4.2(V+)

Not connected (* = marked no-connect by the designer): U4 7(DOUT2)* 8(RIN2)* 9(ROUT2)* 10(DIN2)*

### Notes on the sheet
- RS232

### Library data of the parts
C37-C40 = C-100NF,16V,0805: as C7 on sheet [01] - CPU; Supplier 1: Digi-Key; Manufacturer: AVX; Manufacturer Part Number: 0805YA103JAT2A; RoHS: YES; Category: Capacitors; Stock 1: 28062; Pricing 1: 1=0.29, 10=0.204, 25=0.1668, 50=0.1424, 100=0.1221, 250=0.10176, 500=0.09158, 1000=0.07733 (USD); Packaging: Cut Tape (CT); Capacitance: 100nF; Mounting Type: Surface Mount, MLCC; Operating Temperature: -55°C ~ 125°C; Applications: General Purpose; Ratings: -; Package / Case: 0805 (2012 Metric); Size / Dimension: 0.079" L x 0.049" W (2.01mm x 1.25mm); Height - Seated (Max): -; Thickness (Max): 0.037" (0.94mm); Lead Spacing: -; Features: -; Lead Style: -; ComponentLink1URL: http://www.avx.com/docs/Catalogs/ccog.pdf; ComponentLink1Description: http://www.avx.com/docs/Catalogs/ccog.pdf; Supplier Part Number 1: 478-1334-1-ND; ComponentLink2URL: http://www.farnell.com/datasheets/1825494.pdf; ComponentLink2Description: http://www.farnell.com/datasheets/1825494.pdf; ComponentLink3URL: http://datasheets.avx.com/C0GNP0-Dielectric.pdf; ComponentLink3Description: http://datasheets.avx.com/C0GNP0-Dielectric.pdf
U4 = IC-MAX3232E: Dual Channel RS-232 Line Driver/Receiver; TIIntPartnumber: 1A0213; MfrNum: MAX3232ECD; Mfr: TI; Cost10K: 0.81; Cost100: 1.47; Vendor: Digikey; DescriptiveText: Dual Channel RS-232 Line Driver/Receiver; PartName: MAX3232E; Descriptive_Text: Dual Channel RS-232 Line Driver/Receiver; Supplier 1: Digi-Key

## Sheet [03] - RS485.SchDoc
size A4
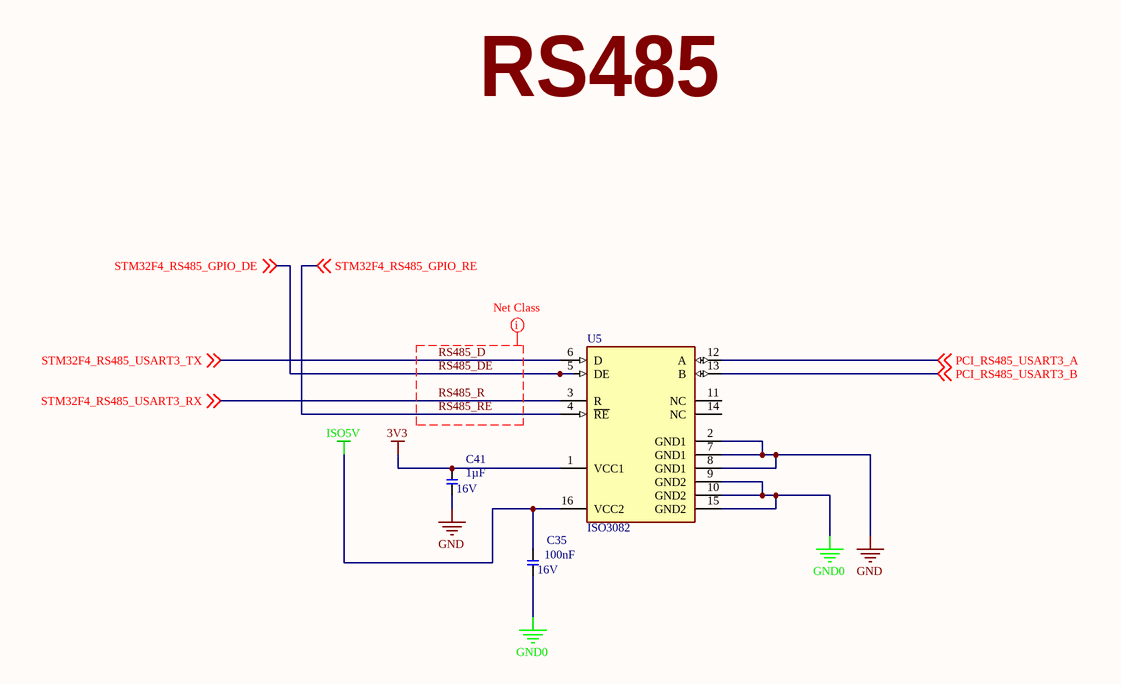
[diagram p3: [03] - RS485.SchDoc]

### Parts
C35  100nF  Voltage - Rated: 16V  [C0805]
C41  1µF  Voltage - Rated: 16V  [C0805]
U5  ISO3082  [DW16_L]

### Nets
3V3: C41.2 U5.1(VCC1)
GND: C41.1 U5.2(GND1) U5.7(GND1) U5.8(GND1)
GND0: C35.1 U5.9(GND2) U5.10(GND2) U5.15(GND2)
ISO5V: C35.2 U5.16(VCC2)
PCI_RS485_USART3_A: U5.12(A) ; off-sheet PCI_RS485_USART3_A
PCI_RS485_USART3_B: U5.13(B) ; off-sheet PCI_RS485_USART3_B
RS485_D: U5.6(D) ; off-sheet STM32F4_RS485_USART3_TX  [also labelled STM32F4_RS485_USART3_TX]
RS485_DE: U5.5(DE) ; off-sheet STM32F4_RS485_GPIO_DE  [also labelled STM32F4_RS485_GPIO_DE]
RS485_R: U5.3(R) ; off-sheet STM32F4_RS485_USART3_RX  [also labelled STM32F4_RS485_USART3_RX]
RS485_RE: U5.4(~{RE}) ; off-sheet STM32F4_RS485_GPIO_RE  [also labelled STM32F4_RS485_GPIO_RE]

Not connected (* = marked no-connect by the designer): U5 11(NC) 14(NC)

### Layout directives
net class RS485: RS485_D, RS485_DE, RS485_R, RS485_RE

### Notes on the sheet
- RS485

### Library data of the parts
C35 = C-100NF,16V,0805: as C7 on sheet [01] - CPU; Supplier 1: Digi-Key; Manufacturer: AVX; Manufacturer Part Number: 0805YA103JAT2A; RoHS: YES; Stock 1: 28062; Pricing 1: 1=0.29, 10=0.204, 25=0.1668, 50=0.1424, 100=0.1221, 250=0.10176, 500=0.09158, 1000=0.07733 (USD); Capacitance: 100nF; Packaging: Cut Tape (CT); ComponentLink1URL: http://www.avx.com/docs/Catalogs/ccog.pdf; ComponentLink1Description: http://www.avx.com/docs/Catalogs/ccog.pdf; Supplier Part Number 1: 478-1334-1-ND; ComponentLink2URL: http://www.farnell.com/datasheets/1825494.pdf; ComponentLink2Description: http://www.farnell.com/datasheets/1825494.pdf; Category: Capacitors; Mounting Type: Surface Mount, MLCC; Operating Temperature: -55°C ~ 125°C; Applications: General Purpose; Ratings: -; Package / Case: 0805 (2012 Metric); Size / Dimension: 0.079" L x 0.049" W (2.01mm x 1.25mm); Height - Seated (Max): -; Thickness (Max): 0.037" (0.94mm); Lead Spacing: -; Features: -; Lead Style: -; ComponentLink3URL: http://datasheets.avx.com/C0GNP0-Dielectric.pdf; ComponentLink3Description: http://datasheets.avx.com/C0GNP0-Dielectric.pdf
C41 = C-1UF,16V,0805: as C3 on sheet [01] - CPU; Supplier 1: Digi-Key; Manufacturer Part Number: 0805YC105KAT2A; RoHS: RoHS Compliant; Stock 1: 76930; Pricing 1: 1=0.19, 10=0.132, 25=0.0964, 50=0.075, 100=0.0622, 250=0.05148, 500=0.04362, 1000=0.03611 (USD); ComponentLink1URL: http://datasheets.avx.com/X7RDielectric.pdf; ComponentLink1Description: http://datasheets.avx.com/X7RDielectric.pdf; Supplier Part Number 1: 478-5034-1-ND; Category: Capacitors; Packaging: Cut Tape (CT); Temperature Coefficient: X7R; Mounting Type: Surface Mount, MLCC; Operating Temperature: -55°C ~ 125°C; Applications: General Purpose; Ratings: -; Package / Case: 0805 (2012 Metric); Size / Dimension: 0.079" L x 0.049" W (2.01mm x 1.25mm); Height - Seated (Max): -; Thickness (Max): 0.055" (1.40mm); Lead Spacing: -; Features: -; Lead Style: -; Capacitance: 1µF
U5 = IC-ISO3082-SOIC-DW-16: DG ISO 2.5KV RS422/RS485 16SOIC; Manufacturer: Texas Instruments; Manufacturer Part Number: ISO3082DWR; Isolated Power: No; Number of Channels: 3; Inputs - Side 1/Side 2: 2/1; Channel Type: Unidirectional; Voltage - Isolation: 2500Vrms; Common Mode Transient Immunity (Min): 25kV/µs; Data Rate: 200kbps; Voltage - Supply: 3.15 V ~ 5.5 V, 4.5 V ~ 5.5 V; Supplier 1: Digi-Key; RoHS: RoHS Compliant; Stock 1: 9564; Pricing 1: 1=6.39, 10=5.733, 100=4.7034, 500=4.0014, 1000=2.925 (USD); ComponentLink1URL: http://www.ti.com/lit/ds/symlink/iso3082.pdf; ComponentLink1Description: http://www.ti.com/lit/ds/symlink/iso3082.pdf; Supplier Part Number 1: 296-37891-6-ND; Category: Isolators; Packaging: Digi-Reel®; Technology: Capacitive Coupling; Type: RS422, RS485; Propagation Delay tpLH / tpHL (Max): -; Pulse Width Distortion (Max): -; Rise / Fall Time (Typ): -; Operating Temperature: -40°C ~ 85°C; Package / Case: 16-SOIC (0.295", 7.50mm Width); Supplier Device Package: 16-SOIC

## Sheet [04] - ETHERNET.SchDoc
size A2
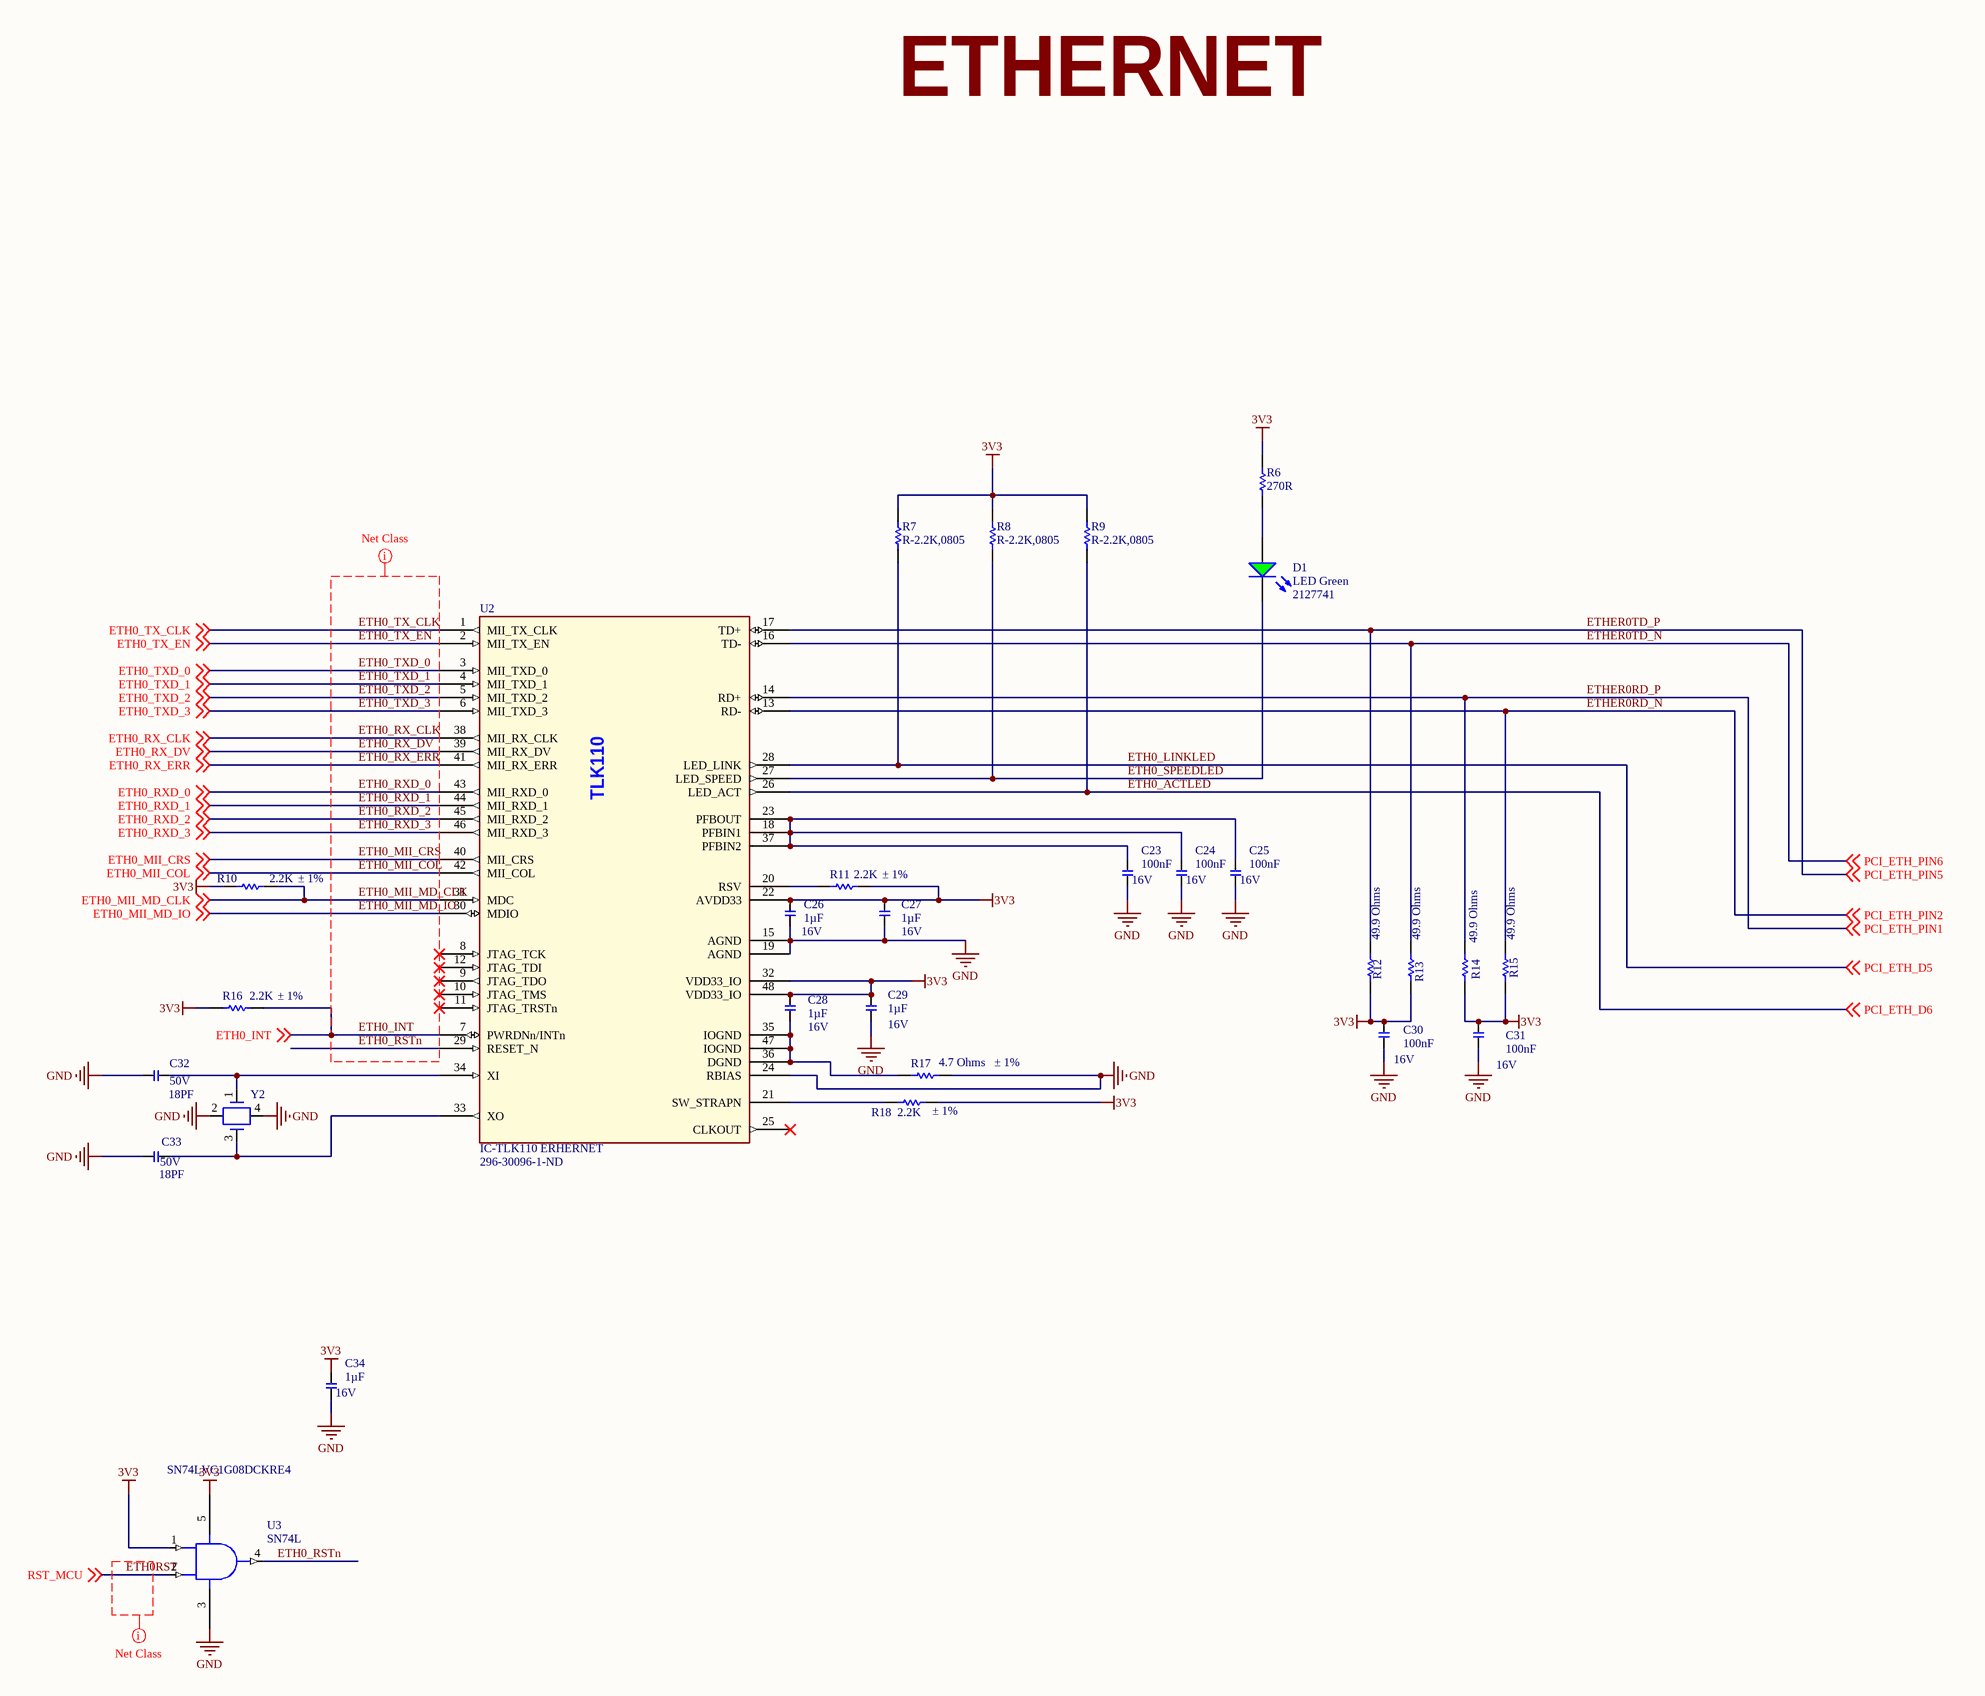
[diagram p4: [04] - ETHERNET.SchDoc]

### Parts
C23  100nF  Voltage - Rated: 16V  [C0805]
C24  100nF  Voltage - Rated: 16V  [C0805]
C25  100nF  Voltage - Rated: 16V  [C0805]
C26  1µF  Voltage - Rated: 16V  [C0805]
C27  1µF  Voltage - Rated: 16V  [C0805]
C28  1µF  Voltage - Rated: 16V  [C0805]
C29  1µF  Voltage - Rated: 16V  [C0805]
C30  100nF  Voltage - Rated: 16V  [C0805]
C31  100nF  Voltage - Rated: 16V  [C0805]
C32  18PF  voltage_rating_dc: 50V  [C0805]
C33  18PF  voltage_rating_dc: 50V  [C0805]
C34  1µF  Voltage - Rated: 16V  [C0805]
D1  LED Green  Supplier Part Number 1: 2127741  [LED_0805]
R6  270R  [R0805]
R7  R-2.2K,0805  [R0805]
R8  R-2.2K,0805  [R0805]
R9  R-2.2K,0805  [R0805]
R10  2.2K  Resistance Tolerance: ± 1%  [R0805]
R11  2.2K  Resistance Tolerance: ± 1%  [R0805]
R12  49.9 Ohms  [R0805]
R13  49.9 Ohms  [R0805]
R14  49.9 Ohms  [R0805]
R15  49.9 Ohms  [R0805]
R16  2.2K  Resistance Tolerance: ± 1%  [R0805]
R17  4.7 Ohms  Resistance Tolerance: ± 1%  [R0805]
R18  2.2K  Resistance Tolerance: ± 1%  [R0805]
U2  IC-TLK110 ERHERNET  Supplier Part Number 1: 296-30096-1-ND  [STM-LQFP48_M]
U3  SN74L  Manufacturer Part Number: SN74LVC1G08DCKRE4  [sm-so-sc70-5]
Y2  25MHz  [ABM8G]  (value not drawn)

### Nets
3V3: C26.2 C27.2 C28.2 C29.2 C30.2 C31.2 C34.2 R6.2 R7.2 R8.2 R9.2 R10.1 R11.2 R12.1 R13.1 R14.1 R15.1 R16.1 R18.2 U2.22(AVDD33) U2.32(VDD33_IO) U2.48(VDD33_IO) U3.1(A) U3.5(VCC)
GND: C23.1 C24.1 C25.1 C26.1 C27.1 C29.1 C30.1 C31.1 C32.1 C33.1 C34.1 R17.1 U2.15(AGND) U2.19(AGND) U2.24(RBIAS) U3.3(GND) Y2.2 Y2.4
ETH0_ACTLED: R9.1 U2.26(LED_ACT) ; off-sheet PCI_ETH_D6  [also labelled PCI_ETH_D6]
ETH0_INT: R16.2 U2.7(PWRDNn/INTn) ; off-sheet ETH0_INT
ETH0_LINKLED: R7.1 U2.28(LED_LINK) ; off-sheet PCI_ETH_D5  [also labelled PCI_ETH_D5]
ETH0_MII_COL: U2.42(MII_COL) ; off-sheet ETH0_MII_COL
ETH0_MII_CRS: U2.40(MII_CRS) ; off-sheet ETH0_MII_CRS
ETH0_MII_MD_CLK: R10.2 U2.31(MDC) ; off-sheet ETH0_MII_MD_CLK
ETH0_MII_MD_IO: U2.30(MDIO) ; off-sheet ETH0_MII_MD_IO
ETH0_RSTn: U2.29(RESET_N) U3.4(Y)
ETH0_RX_CLK: U2.38(MII_RX_CLK) ; off-sheet ETH0_RX_CLK
ETH0_RX_DV: U2.39(MII_RX_DV) ; off-sheet ETH0_RX_DV
ETH0_RX_ERR: U2.41(MII_RX_ERR) ; off-sheet ETH0_RX_ERR
ETH0_RXD_0: U2.43(MII_RXD_0) ; off-sheet ETH0_RXD_0
ETH0_RXD_1: U2.44(MII_RXD_1) ; off-sheet ETH0_RXD_1
ETH0_RXD_2: U2.45(MII_RXD_2) ; off-sheet ETH0_RXD_2
ETH0_RXD_3: U2.46(MII_RXD_3) ; off-sheet ETH0_RXD_3
ETH0_SPEEDLED: D1.1(K) R8.1 U2.27(LED_SPEED)
ETH0_TX_CLK: U2.1(MII_TX_CLK) ; off-sheet ETH0_TX_CLK
ETH0_TX_EN: U2.2(MII_TX_EN) ; off-sheet ETH0_TX_EN
ETH0_TXD_0: U2.3(MII_TXD_0) ; off-sheet ETH0_TXD_0
ETH0_TXD_1: U2.4(MII_TXD_1) ; off-sheet ETH0_TXD_1
ETH0_TXD_2: U2.5(MII_TXD_2) ; off-sheet ETH0_TXD_2
ETH0_TXD_3: U2.6(MII_TXD_3) ; off-sheet ETH0_TXD_3
ETH0RST: U3.2(B) ; off-sheet RST_MCU  [also labelled RST_MCU]
ETHER0RD_N: R15.2 U2.13(RD-) ; off-sheet PCI_ETH_PIN2  [also labelled PCI_ETH_PIN2]
ETHER0RD_P: R14.2 U2.14(RD+) ; off-sheet PCI_ETH_PIN1  [also labelled PCI_ETH_PIN1]
ETHER0TD_N: R13.2 U2.16(TD-) ; off-sheet PCI_ETH_PIN6  [also labelled PCI_ETH_PIN6]
ETHER0TD_P: R12.2 U2.17(TD+) ; off-sheet PCI_ETH_PIN5  [also labelled PCI_ETH_PIN5]
NetC23_2: C23.2 C24.2 C25.2 U2.18(PFBIN1) U2.23(PFBOUT) U2.37(PFBIN2)
NetC28_1: C28.1 R17.2 U2.35(IOGND) U2.36(DGND) U2.47(IOGND)
NetC32_2: C32.2 U2.34(XI) Y2.1
NetC33_2: C33.2 U2.33(XO) Y2.3
NetD1_2: D1.2(A) R6.1
NetR11_1: R11.1 U2.20(RSV)
NetR18_1: R18.1 U2.21(SW_STRAPN)

Not connected (* = marked no-connect by the designer): U2 8(JTAG_TCK)* 9(JTAG_TDO)* 10(JTAG_TMS)* 11(JTAG_TRSTn)* 12(JTAG_TDI)* 25(CLKOUT)*

### Layout directives
net class ETHERNET: ETH0_INT, ETH0_MII_COL, ETH0_MII_CRS, ETH0_MII_MD_CLK, ETH0_MII_MD_IO, ETH0_RSTn, ETH0_RX_CLK, ETH0_RX_DV, ETH0_RX_ERR, ETH0_RXD_0, ETH0_RXD_1, ETH0_RXD_2, ETH0_RXD_3, ETH0_TX_CLK, ETH0_TX_EN, ETH0_TXD_0, ETH0_TXD_1, ETH0_TXD_2, ETH0_TXD_3, ETH0RST

### Notes on the sheet
- ETHERNET
- (in symbol IC-TLK110 ERHERNET) TLK110

### Library data of the parts
C23-C25 C30 C31 = C-100NF,16V,0805: as C7 on sheet [01] - CPU; Supplier 1: Digi-Key; Manufacturer: AVX; Manufacturer Part Number: 0805YA103JAT2A; RoHS: YES; Stock 1: 28062; Pricing 1: 1=0.29, 10=0.204, 25=0.1668, 50=0.1424, 100=0.1221, 250=0.10176, 500=0.09158, 1000=0.07733 (USD); Capacitance: 100nF; Packaging: Cut Tape (CT); ComponentLink1URL: http://www.avx.com/docs/Catalogs/ccog.pdf; ComponentLink1Description: http://www.avx.com/docs/Catalogs/ccog.pdf; Supplier Part Number 1: 478-1334-1-ND; ComponentLink2URL: http://www.farnell.com/datasheets/1825494.pdf; ComponentLink2Description: http://www.farnell.com/datasheets/1825494.pdf; Category: Capacitors; Mounting Type: Surface Mount, MLCC; Operating Temperature: -55°C ~ 125°C; Applications: General Purpose; Ratings: -; Package / Case: 0805 (2012 Metric); Size / Dimension: 0.079" L x 0.049" W (2.01mm x 1.25mm); Height - Seated (Max): -; Thickness (Max): 0.037" (0.94mm); Lead Spacing: -; Features: -; Lead Style: -; ComponentLink3URL: http://datasheets.avx.com/C0GNP0-Dielectric.pdf; ComponentLink3Description: http://datasheets.avx.com/C0GNP0-Dielectric.pdf
C26-C29 C34 = C-1UF,16V,0805: as C3 on sheet [01] - CPU; Supplier 1: Digi-Key; Manufacturer Part Number: 0805YC105KAT2A; RoHS: RoHS Compliant; Stock 1: 76930; Pricing 1: 1=0.19, 10=0.132, 25=0.0964, 50=0.075, 100=0.0622, 250=0.05148, 500=0.04362, 1000=0.03611 (USD); ComponentLink1URL: http://datasheets.avx.com/X7RDielectric.pdf; ComponentLink1Description: http://datasheets.avx.com/X7RDielectric.pdf; Supplier Part Number 1: 478-5034-1-ND; Category: Capacitors; Packaging: Cut Tape (CT); Temperature Coefficient: X7R; Mounting Type: Surface Mount, MLCC; Operating Temperature: -55°C ~ 125°C; Applications: General Purpose; Ratings: -; Package / Case: 0805 (2012 Metric); Size / Dimension: 0.079" L x 0.049" W (2.01mm x 1.25mm); Height - Seated (Max): -; Thickness (Max): 0.055" (1.40mm); Lead Spacing: -; Features: -; Lead Style: -; Capacitance: 1µF
C32 C33 = C-18PF,50V,0805: as C4 on sheet [01] - CPU; Supplier 1: Octopart; Manufacturer: Multicomp; Manufacturer Part Number: MC0805N180J500CT; Pricing 1: 1=0.11400, 10=0.07300, 50=0.04100, 100=0.03200, 250=0.02600, 500=0.02200, 1000=0.01800 (USD); capacitance: 18PF; ComponentLink1URL: http://datasheet.octopart.com/MC0805N180J500CT-Multicomp-datasheet-16478625.pdf; ComponentLink1Description: http://datasheet.octopart.com/MC0805N180J500CT-Multicomp-datasheet-16478625.pdf; Supplier Part Number 1: Newark - 06R4039; Stock 1: 3187; reach_svhc_compliance: No SVHC; rohs_status: Compliant; dielectric_characteristic: C0G/NP0; Octopart Url: http://octopart.com/mc0805n180j500ct-multicomp-10529169; Seller Landing  Url: https://octopart-clicks.com/click/track?country=TR&ak=8157f166&sig=03c9fd1&sid=2402&ppid=10529169&vpid=17760821&ct=offers; OctopartID: 811748bd0de05ed0; ComponentLink2URL: http://datasheet.octopart.com/MC0805N180J500CT-Multicomp-datasheet-22150886.pdf; ComponentLink2Description: http://datasheet.octopart.com/MC0805N180J500CT-Multicomp-datasheet-22150886.pdf; ComponentLink3URL: http://datasheet.octopart.com/MC0805N180J500CT-Multicomp-datasheet-8445804.pdf; ComponentLink3Description: http://datasheet.octopart.com/MC0805N180J500CT-Multicomp-datasheet-8445804.pdf; ComponentLink4URL: http://datasheet.octopart.com/MC0805N180J500CT-Multicomp-datasheet-34215986.pdf; ComponentLink4Description: http://datasheet.octopart.com/MC0805N180J500CT-Multicomp-datasheet-34215986.pdf; ComponentLink5URL: http://datasheet.octopart.com/MC0805N180J500CT-Multicomp-datasheet-26590290.pdf; ComponentLink5Description: http://datasheet.octopart.com/MC0805N180J500CT-Multicomp-datasheet-26590290.pdf; ComponentLink6URL: http://datasheet.octopart.com/MC0805N180J500CT-Multicomp-datasheet-15500401.pdf; ComponentLink6Description: http://datasheet.octopart.com/MC0805N180J500CT-Multicomp-datasheet-15500401.pdf; ComponentLink7URL: http://datasheet.octopart.com/MC0805N180J500CT-Multicomp-datasheet-10838970.pdf; ComponentLink7Description: http://datasheet.octopart.com/MC0805N180J500CT-Multicomp-datasheet-10838970.pdf
D1 = LED-Green SMD 20mA 2V 0805: LED Green SMD 20mA 2V 0805; TIIntPartnumber: 1F0008; MfrNum: 598-8170-107F; Mfr: Dialight; PartName: LEDGreen2x1.5; Cost10K: 0.052; Cost100: 0.081; Vendor: Digikey; DescriptiveText: LED Green SMD 20mA 2V 0805; Descriptive_Text: LED Green SMD 20mA 2V 0805; Supplier 1: Farnell
R6 = R-270R,0805: TE CONNECTIVITY / NEOHM 270R Thin Film; Manufacturer Part Number: CPF0805B270RE1; Product Range: TE CONNECTIVITY - CPF Series; Resistance: 270 Ohms; Power Rating: 100; Resistance Tolerance: ± 0.1%; Resistor Case Style: 0805 [2012 Metric]; Temperature Coefficient: ± 25; Voltage Rating: 200; External Depth: 0.5; External Length / Height: 2; External Width: 1.25; Resistor Mounting: SMD; Supplier 1: Farnell; Manufacturer: TE CONNECTIVITY / NEOHM; RoHS: YES; Stock 1: 755; Pricing 1: 10=0,43, 50=0,34, 100=0,32, 500=0,27, 1000=0,24 (EUR); Resistor Element Material: Thin Film; Packaging: Cut Tape; MSL: -; No. of Pins: 2; Operating Temperature Max: 155; Operating Temperature Min: -55; Operating Temperature Range: -55°C to +155; Series: CPF<!--FANDB--><div class="features-and-benefits-container"></div>; ComponentLink1URL: http://www.tycoelectronics.com/commerce/DocumentDelivery/DDEController?Action=srchrtrv&DocNm=1614884&DocType=Customer+Drawing&DocLang=English; ComponentLink1Description: http://www.tycoelectronics.com/commerce/DocumentDelivery/DDEController?Action=srchrtrv&DocNm=1614884&DocType=Customer+Drawing&DocLang=English; ComponentLink2URL: http://www.tycoelectronics.com/commerce/DocumentDelivery/DDEController?Action=srchrtrv&DocNm=1773200&DocType=Data+Sheet&DocLang=English; ComponentLink2Description: http://www.tycoelectronics.com/commerce/DocumentDelivery/DDEController?Action=srchrtrv&DocNm=1773200&DocType=Data+Sheet&DocLang=English; Supplier Part Number 1: 1697424
R7-R11 R16 R18 = R-2.2K,0805: PANASONIC - ERJP06F2201V - RESISTOR, THICK FILM, 2.2 KOHM, 0.5W, 1%; Product Range: PANASONIC - ERJ Series; Resistance: 2.2K Ohms; Power Rating: 500; Resistor Case Style: 0805 [2012 Metric]; Temperature Coefficient: ± 100; Voltage Rating: 400; SVHC: No SVHC (16-Dec-2013); External Depth: 1.25; External Length / Height: 0.6; External Width: 2; Overload Voltage: 600; Reel Quantity: 5000; Resistor Mounting: SMD; Supplier 1: Farnell; Manufacturer: PANASONIC; Manufacturer Part Number: ERJP06F2201V; RoHS: YES; Stock 1: 750; Pricing 1: 25=0,127, 100=0,105, 500=0,0858, 1000=0,065, 5000=0,0624 (EUR); Resistor Element Material: Thick Film; Packaging: Cut Tape; MSL: -; No. of Pins: 2; Operating Temperature Max: 155; Operating Temperature Min: -55; Operating Temperature Range: -55°C to +155; Series: ERJP<!--FANDB--><div class="features-and-benefits-container"></div>; ComponentLink1URL: http://www.farnell.com/datasheets/1801181.pdf; ComponentLink1Description: http://www.farnell.com/datasheets/1801181.pdf; ComponentLink2URL: http://www.farnell.com/datasheets/1718548.pdf; ComponentLink2Description: http://www.farnell.com/datasheets/1718548.pdf; ComponentLink3URL: http://www.farnell.com/cad/1697897.zip; ComponentLink3Description: http://www.farnell.com/cad/1697897.zip; Supplier Part Number 1: 1750759
  R7-R9: Resistance Tolerance: ± 1%
R12-R15 = R-49.9R,0805: as R5 on sheet [01] - CPU; Supplier 1: Farnell; Manufacturer: PANASONIC; Manufacturer Part Number: ERJP06F49R9V; RoHS: YES; Stock 1: 3370; Pricing 1: 25=0,078, 100=0,0728, 500=0,0429, 1000=0,0312, 5000=0,0234 (EUR); Resistance: 49.9 Ohms; Resistance Tolerance: ± 1%; Resistor Element Material: Thick Film; Packaging: Cut Tape; MSL: -; ComponentLink1URL: http://www.farnell.com/datasheets/1801181.pdf; ComponentLink1Description: http://www.farnell.com/datasheets/1801181.pdf; ComponentLink2URL: http://www.farnell.com/datasheets/1718548.pdf; ComponentLink2Description: http://www.farnell.com/datasheets/1718548.pdf; Supplier Part Number 1: 2312274
R17 = R-4.7K,0805: BOURNS - CR0805-FX-4701GLF - RESISTOR, 4.7K, 0.125W, 1%; Product Range: BOURNS - CR Series; Power Rating: 125; Resistor Case Style: 0805 [2012 Metric]; Resistor Element Material: Thick Film; Temperature Coefficient: ± 100; Voltage Rating: 150; SVHC: No SVHC (16-Jun-2014); Resistor Mounting: SMD<!--FANDB--><div class="features-and-benefits-container"></div>; Supplier 1: Farnell; Manufacturer: BOURNS; Manufacturer Part Number: CR0805-FX-4701GLF; RoHS: YES; Stock 1: 20050; Pricing 1: 50=0,0312, 250=0,0247, 1000=0,0234, 5000=0,0156, 10000=0,0143 (EUR); Resistance: 4.7 Ohms; Packaging: Cut Tape; MSL: MSL 1 - Unlimited; ComponentLink1URL: http://www.farnell.com/datasheets/1845293.pdf; ComponentLink1Description: http://www.farnell.com/datasheets/1845293.pdf; Supplier Part Number 1: 2008383
U2 = IC-TLK110 ERHERNET: IC ETHERNET PHY 10/100 48LQFP; Manufacturer: Texas Instruments; Manufacturer Part Number: TLK110PTR; Protocol: MII, RMII; Number of Drivers/Receivers: 1/1; Duplex: Full; Voltage - Supply: 3 V ~ 3.6 V; Supplier 1: Digi-Key; RoHS: RoHS Compliant; Category: Integrated Circuits (ICs); Stock 1: 1906; Pricing 1: 1=6.63, 10=5.954, 100=4.8843, 500=4.1553, 1000=3.0375 (USD); Packaging: Cut Tape (CT); Type: Transceiver; Receiver Hysteresis: -; Data Rate: -; Operating Temperature: -40°C ~ 85°C; Mounting Type: Surface Mount; Package / Case: 48-LQFP; Supplier Device Package: 48-LQFP (7x7); ComponentLink1URL: http://www.ti.com/lit/ds/symlink/tlk110.pdf; ComponentLink1Description: http://www.ti.com/lit/ds/symlink/tlk110.pdf
U3 = IC-SN74LVC1G08DCKRE4- AND 1 CH: IC GATE AND 1CH 2-INP SC-70-5; Manufacturer: Texas Instruments; Logic Type: AND Gate; Number of Circuits: 1; Number of Inputs: 2; Voltage - Supply: 1.65 V ~ 5.5 V; Current - Quiescent (Max): 10µA; Current - Output High, Low: 32mA, 32mA; Max Propagation Delay @ V, Max CL: 4ns @ 5V, 50pF; Supplier 1: Digi-Key; Supplier Part Number 1: 296-35940-6-ND; RoHS: RoHS Compliant; Category: Integrated Circuits (ICs); Stock 1: 8395; Pricing 1: 1=0.42, 10=0.315, 100=0.196, 500=0.134, 1000=0.103 (USD); Packaging: Digi-Reel®; Features: -; Logic Level - Low: -; Logic Level - High: -; Operating Temperature: -40°C ~ 125°C; Mounting Type: Surface Mount; Supplier Device Package: SC-70-5; Package / Case: 5-TSSOP, SC-70-5, SOT-353; ComponentLink1URL: http://www.ti.com/lit/ds/symlink/sn74lvc1g08.pdf; ComponentLink1Description: http://www.ti.com/lit/ds/symlink/sn74lvc1g08.pdf
Y2 = OSC-Crystal25MHz-R: RALTRON - RH100-25.000-18-F-3030-EXT - CRYSTAL, 25MHZ, 18PF, 3.2MM X 2.5MM; Product Range: RH100 Series; Frequency Nom: 25; Frequency Stability + / -: 30; Crystal Case: SMD, 3.2mm x 2.5; Load Capacitance: 18; SVHC: No SVHC (17-Dec-2015); Supplier 1: Farnell; Manufacturer: RALTRON; Manufacturer Part Number: RH100-25.000-18-F-3030-EXT; RoHS: YES; Pricing 1: 1=0.81, 5=0.75, 10=0.68, 20=0.61, 40=0.58, 100=0.54, 500=0.529, 1000=0.518 (GBP); Frequency Tolerance + / -: 30; Operating Temperature Min: -40; Operating Temperature Max: 85; MSL: MSL 1 - Unlimited<!--FANDB--><div class="features-and-benefits-container"></div>; ComponentLink1URL: http://www.farnell.com/datasheets/1998832.pdf; ComponentLink1Description: http://www.farnell.com/datasheets/1998832.pdf; Supplier Part Number 1: 2509084RL

## Sheet [05] - MINIPCICONN.SchDoc
size A2
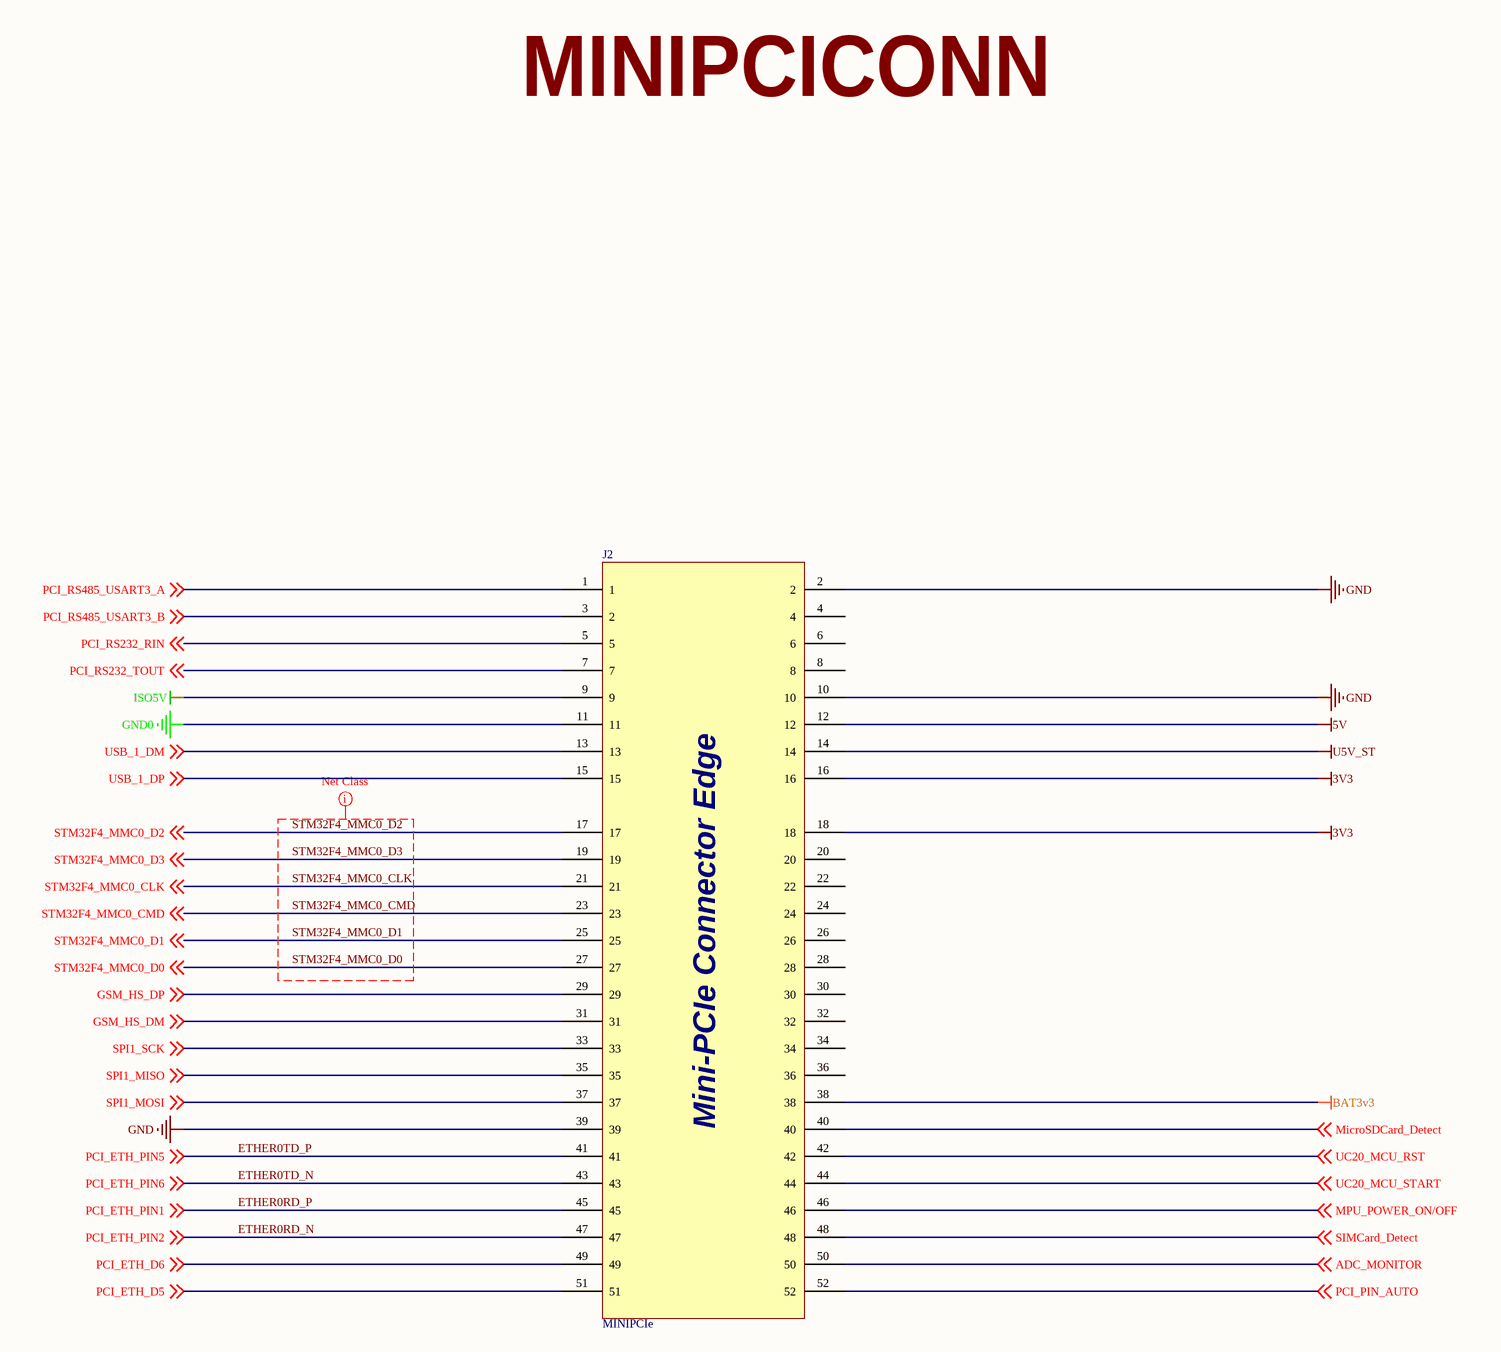
[diagram p5: [05] - MINIPCICONN.SchDoc]

### Parts
J2  MINIPCIe  [MINI PCIe]

### Nets
3V3: J2.16 J2.18
5V: J2.12
BAT3v3: J2.38
GND: J2.2 J2.10 J2.39
GND0: J2.11
ISO5V: J2.9
U5V_ST: J2.14
ADC_MONITOR: J2.50 ; off-sheet ADC_MONITOR
ETHER0RD_N: J2.47 ; off-sheet PCI_ETH_PIN2  [also labelled PCI_ETH_PIN2]
ETHER0RD_P: J2.45 ; off-sheet PCI_ETH_PIN1  [also labelled PCI_ETH_PIN1]
ETHER0TD_N: J2.43 ; off-sheet PCI_ETH_PIN6  [also labelled PCI_ETH_PIN6]
ETHER0TD_P: J2.41 ; off-sheet PCI_ETH_PIN5  [also labelled PCI_ETH_PIN5]
GSM_HS_DM: J2.31 ; off-sheet GSM_HS_DM
GSM_HS_DP: J2.29 ; off-sheet GSM_HS_DP
MicroSDCard_Detect: J2.40 ; off-sheet MicroSDCard_Detect
MPU_POWER_ON/OFF: J2.46 ; off-sheet MPU_POWER_ON/OFF
PCI_ETH_D5: J2.51 ; off-sheet PCI_ETH_D5  [project net ETH0_LINKLED]
PCI_ETH_D6: J2.49 ; off-sheet PCI_ETH_D6  [project net ETH0_ACTLED]
PCI_PIN_AUTO: J2.52 ; off-sheet PCI_PIN_AUTO  [project net ETH0RST]
PCI_RS232_RIN: J2.5 ; off-sheet PCI_RS232_RIN
PCI_RS232_TOUT: J2.7 ; off-sheet PCI_RS232_TOUT
PCI_RS485_USART3_A: J2.1 ; off-sheet PCI_RS485_USART3_A
PCI_RS485_USART3_B: J2.3(2) ; off-sheet PCI_RS485_USART3_B
SIMCard_Detect: J2.48 ; off-sheet SIMCard_Detect
SPI1_MISO: J2.35 ; off-sheet SPI1_MISO
SPI1_MOSI: J2.37 ; off-sheet SPI1_MOSI
SPI1_SCK: J2.33 ; off-sheet SPI1_SCK
STM32F4_MMC0_CLK: J2.21 ; off-sheet STM32F4_MMC0_CLK
STM32F4_MMC0_CMD: J2.23 ; off-sheet STM32F4_MMC0_CMD
STM32F4_MMC0_D0: J2.27 ; off-sheet STM32F4_MMC0_D0
STM32F4_MMC0_D1: J2.25 ; off-sheet STM32F4_MMC0_D1
STM32F4_MMC0_D2: J2.17 ; off-sheet STM32F4_MMC0_D2
STM32F4_MMC0_D3: J2.19 ; off-sheet STM32F4_MMC0_D3
UC20_MCU_RST: J2.42 ; off-sheet UC20_MCU_RST
UC20_MCU_START: J2.44 ; off-sheet UC20_MCU_START
USB_1_DM: J2.13 ; off-sheet USB_1_DM
USB_1_DP: J2.15 ; off-sheet USB_1_DP

Not connected (* = marked no-connect by the designer): J2 4 6 8 20 22 24 26 28 30 32 34 36

### Layout directives
net class MMC_SD: STM32F4_MMC0_CLK, STM32F4_MMC0_CMD, STM32F4_MMC0_D0, STM32F4_MMC0_D1, STM32F4_MMC0_D2, STM32F4_MMC0_D3

### Notes on the sheet
- MINIPCICONN
- (in symbol MINIPCIe) Mini-PCIe Connector Edge